# Altium project DMX Interface DB v2.PrjPcb
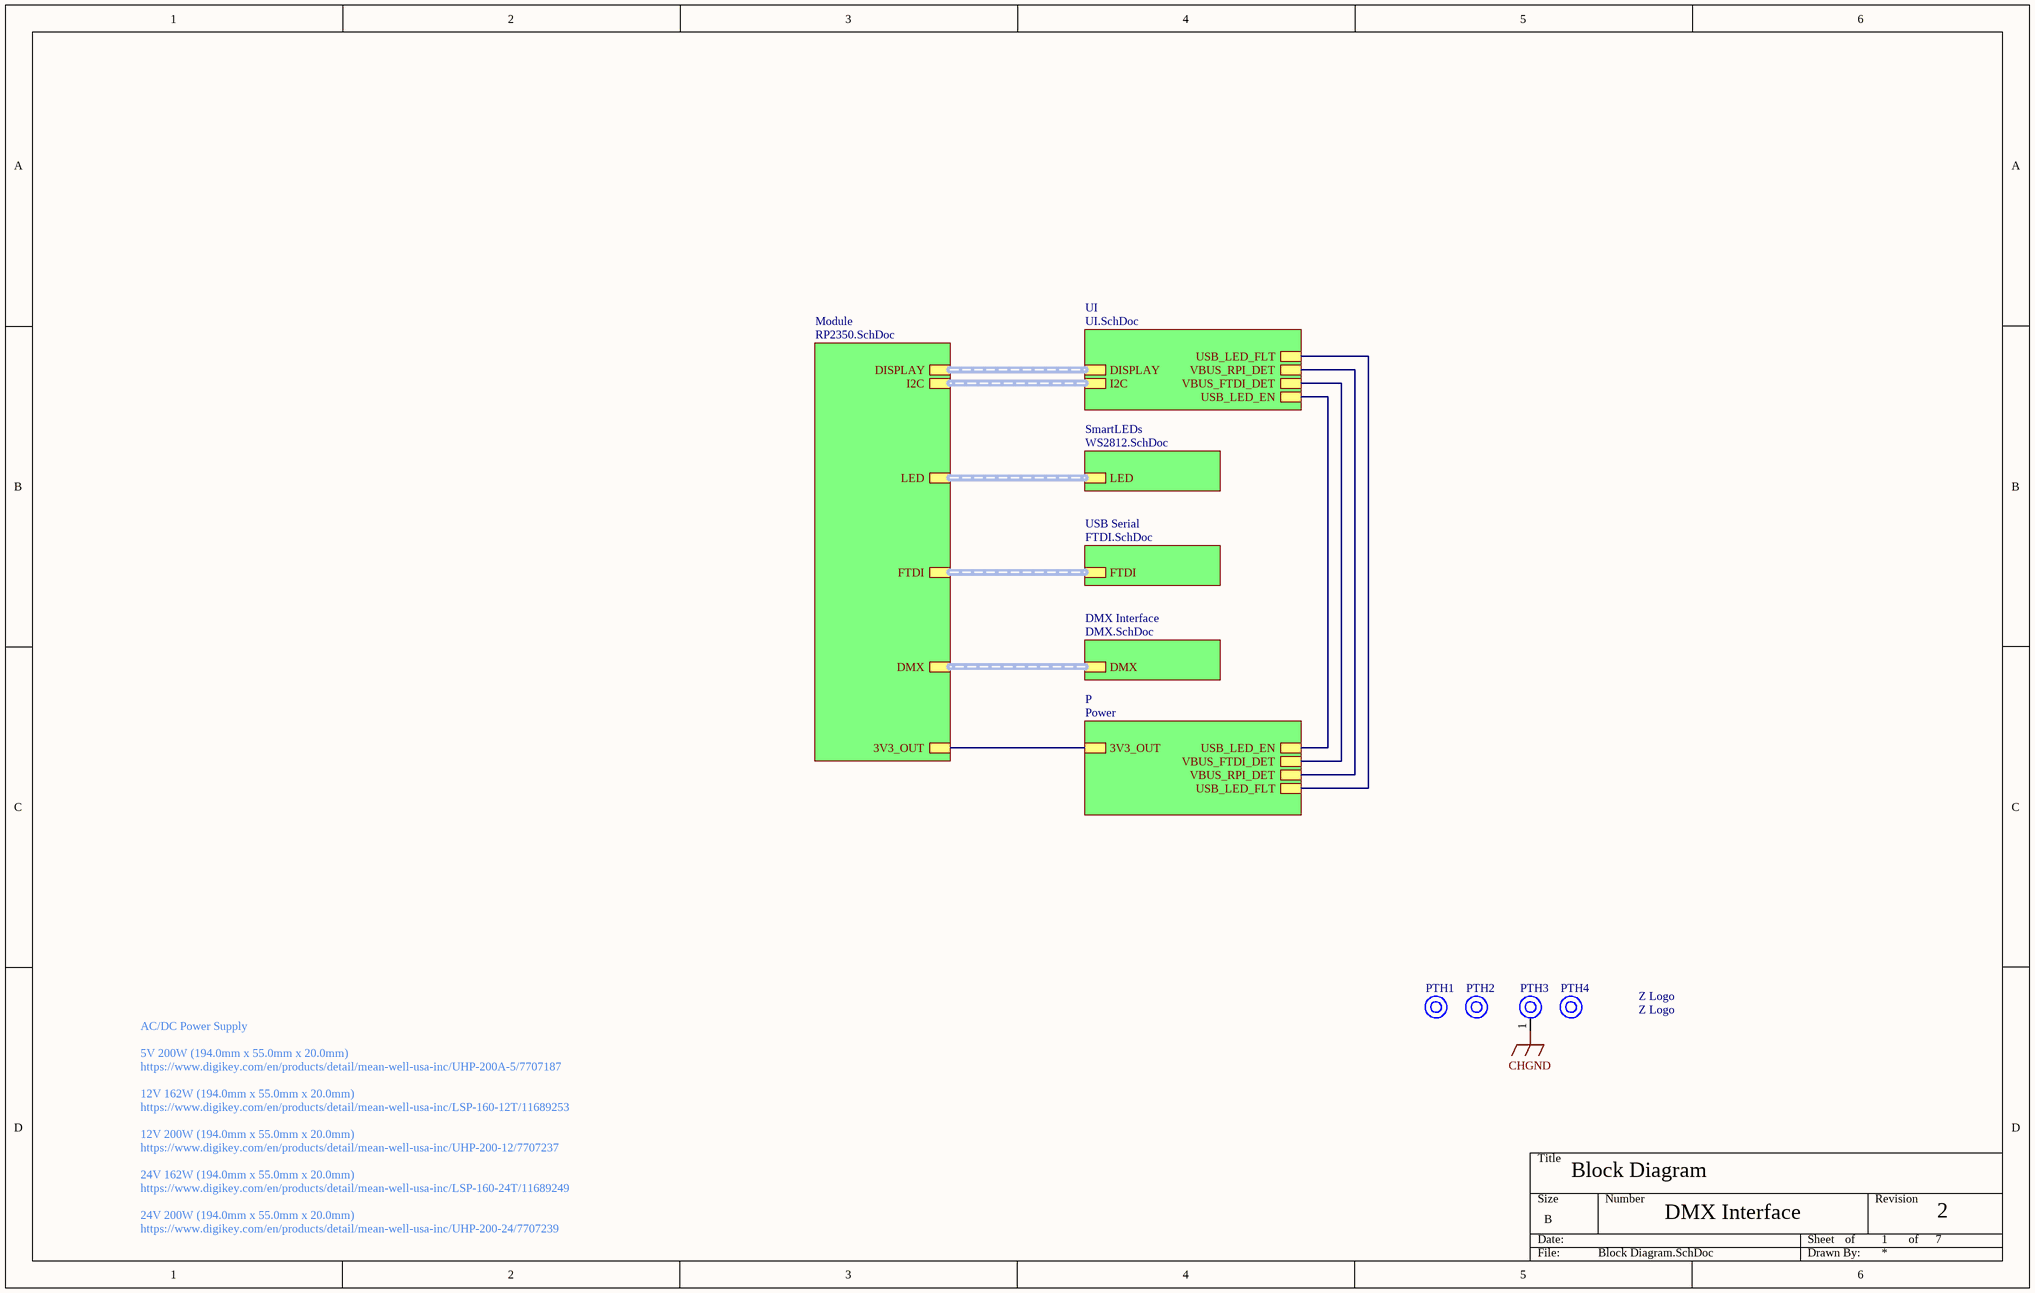
[diagram p0: Block Diagram.SchDoc]
PROJECT_TITLE: DMX Interface; REV: 2
7 sheets, 152 parts. Net scope: hierarchical (ports join the sheet entries above them; power ports are global).
Board file: DMX Interface.PcbDoc
Sheets:
  Block Diagram.SchDoc
    Module = RP2350.SchDoc
    SmartLEDs = WS2812.SchDoc
    DMX Interface = DMX.SchDoc
    USB Serial = FTDI.SchDoc
    P = Power.SchDoc
    UI = UI.SchDoc

## Sheet Block Diagram.SchDoc: Block Diagram
size B; SheetNumber: 1; SheetTotal: 7

### Parts
_1  Z Logo  [Z Logo 0.5"]  (no BOM)
PTH1  Mounting Hole NPTH  [Mounting Hole M3 No Washer NPTH]  (value not drawn)  (no BOM)
PTH2  Mounting Hole NPTH  [Mounting Hole M3 No Washer NPTH]  (value not drawn)  (no BOM)
PTH3  Mounting Hole  [Mounting Hole M3 No Washer]  (value not drawn)  (no BOM)
PTH4  Mounting Hole NPTH  [Mounting Hole M3 No Washer NPTH]  (value not drawn)  (no BOM)

### Sub-sheets
DMX Interface = DMX.SchDoc: DMX (harness DMX)
Module = RP2350.SchDoc: DMX (harness DMX), FTDI (harness FTDI), I2C (harness I2C), LED (harness LED), DISPLAY (harness DISPLAY), 3V3_OUT
P = Power: 3V3_OUT, USB_LED_EN, VBUS_FTDI_DET, VBUS_RPI_DET, USB_LED_FLT
SmartLEDs = WS2812.SchDoc: LED (harness LED)
UI = UI.SchDoc: DISPLAY (harness DISPLAY), I2C (harness I2C), USB_LED_EN, VBUS_FTDI_DET, VBUS_RPI_DET, USB_LED_FLT
USB Serial = FTDI.SchDoc: FTDI (harness FTDI)

### Nets
CHGND: PTH3.1
USB_LED_EN: sheet P/USB_LED_EN, sheet UI/USB_LED_EN
USB_LED_FLT: sheet P/USB_LED_FLT, sheet UI/USB_LED_FLT
VBUS_FTDI_DET: sheet P/VBUS_FTDI_DET, sheet UI/VBUS_FTDI_DET
VBUS_RPI_DET: sheet P/VBUS_RPI_DET, sheet UI/VBUS_RPI_DET
NetJP3_1: sheet Module/3V3_OUT, sheet P/3V3_OUT

### Buses and harness runs
harness sheet DMX Interface/DMX = sheet Module/DMX
harness sheet Module/DISPLAY = sheet UI/DISPLAY
harness sheet Module/FTDI = sheet USB Serial/FTDI
harness sheet Module/I2C = sheet UI/I2C
harness sheet Module/LED = sheet SmartLEDs/LED

### Notes on the sheet
- AC/DC Power Supply
  5V 200W (194.0mm x 55.0mm x 20.0mm)
  https://www.digikey.com/en/products/detail/mean-well-usa-inc/UHP-200A-5/7707187
  12V 162W (194.0mm x 55.0mm x 20.0mm)
  https://www.digikey.com/en/products/detail/mean-well-usa-inc/LSP-160-12T/11689253
  12V 200W (194.0mm x 55.0mm x 20.0mm)
  https://www.digikey.com/en/products/detail/mean-well-usa-inc/UHP-200-12/7707237
  24V 162W (194.0mm x 55.0mm x 20.0mm)
  https://www.digikey.com/en/products/detail/mean-well-usa-inc/LSP-160-24T/11689249
  24V 200W (194.0mm x 55.0mm x 20.0mm)
  https://www.digikey.com/en/products/detail/mean-well-usa-inc/UHP-200-24/7707239
- of

### Library data of the parts
_1 = CMP-00028-00046-1: Z logo silkscreen
PTH1 PTH2 PTH4 = CMP-00028-00043-4
PTH3 = CMP-00028-00008-6

## Sheet RP2350.SchDoc: RP2350
size B; SheetNumber: 2; SheetTotal: 7
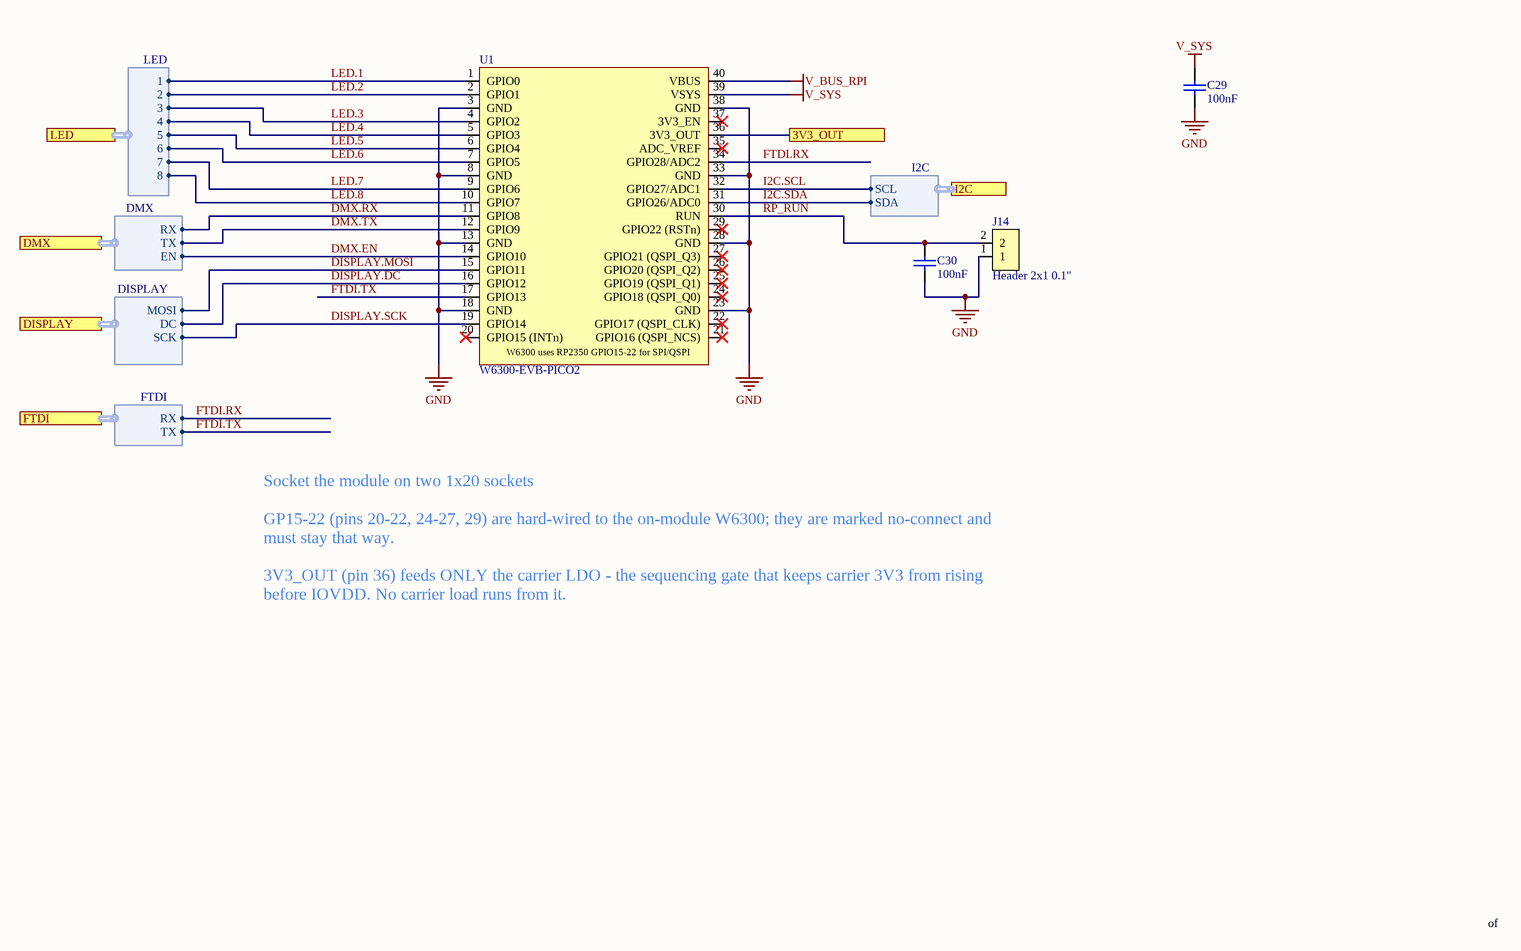
[diagram p1: RP2350.SchDoc]

### Parts
C29  value 100nF  [CAPC1608X10N_0603_MED]  (hidden comment: CC0603KRX7R0BB104)
C30  value 100nF  [CAPC1608X10N_0603_MED]  (hidden comment: CC0603KRX7R0BB104)
J14  Header 2x1 0.1"  [FP-M20-9990245-MFG]
U1  W6300-EVB-PICO2  [W6300-EVB-PICO2_0.4375_standoff]

### Ports
3V3_OUT, DISPLAY (harness DISPLAY), DMX (harness DMX), FTDI (harness FTDI), I2C (harness I2C), LED (harness LED)

### Harnesses
LED: 1, 2, 3, 4, 5, 6, 7, 8
DMX: RX, EN, TX
DISPLAY: MOSI, SCK, DC
FTDI: RX, TX
I2C: SCL, SDA

### Nets
GND: C29.2 C30.2 J14.1 U1.3(GND) U1.8(GND) U1.13(GND) U1.18(GND) U1.23(GND) U1.28(GND) U1.33(GND) U1.38(GND)
V_BUS_RPI: U1.40(VBUS)
V_SYS: C29.1 U1.39(VSYS)
DISPLAY.DC: U1.16(GPIO12) ; port DISPLAY.DC
DISPLAY.MOSI: U1.15(GPIO11) ; port DISPLAY.MOSI
DISPLAY.SCK: U1.19(GPIO14) ; port DISPLAY.SCK
DMX.EN: U1.14(GPIO10) ; port DMX.EN
DMX.RX: U1.11(GPIO8) ; port DMX.RX
DMX.TX: U1.12(GPIO9) ; port DMX.TX
FTDI.RX: U1.34(GPIO28/ADC2) ; port FTDI.RX
FTDI.TX: U1.17(GPIO13) ; port FTDI.TX
I2C.SCL: U1.32(GPIO27/ADC1) ; port I2C.SCL
I2C.SDA: U1.31(GPIO26/ADC0) ; port I2C.SDA
LED.1: U1.1(GPIO0) ; port LED.1
LED.2: U1.2(GPIO1) ; port LED.2
LED.3: U1.4(GPIO2) ; port LED.3
LED.4: U1.5(GPIO3) ; port LED.4
LED.5: U1.6(GPIO4) ; port LED.5
LED.6: U1.7(GPIO5) ; port LED.6
LED.7: U1.9(GPIO6) ; port LED.7
LED.8: U1.10(GPIO7) ; port LED.8
RP_RUN: C30.1 J14.2 U1.30(RUN)
NetJP3_1: U1.36(3V3_OUT) ; port 3V3_OUT

Not connected (* = marked no-connect by the designer): U1 20(GPIO15_(INTn))* 21(GPIO16_(QSPI_NCS))* 22(GPIO17_(QSPI_CLK))* 24(GPIO18_(QSPI_Q0))* 25(GPIO19_(QSPI_Q1))* 26(GPIO20_(QSPI_Q2))* 27(GPIO21_(QSPI_Q3))* 29(GPIO22_(RSTn))* 35(ADC_VREF)* 37(3V3_EN)*

### Notes on the sheet
- Socket the module on two 1x20 sockets
  GP15-22 (pins 20-22, 24-27, 29) are hard-wired to the on-module W6300; they are marked no-connect and must stay that way.
  3V3_OUT (pin 36) feeds ONLY the carrier LDO - the sequencing gate that keeps carrier 3V3 from rising before IOVDD. No carrier load runs from it.
- of
- (in symbol CMP-020-00030-3) W6300 uses RP2350 GPIO15-22 for SPI/QSPI

### Library data of the parts
C29 C30 = CMP-001-00102-4: Ceramic Capacitor, Multilayer, Ceramic, 100V, 10% +Tol, 10% -Tol, X7R, 15% TC, 0.1uF, Surface Mount, 0603; Max Operating Temperature: 125°C; RoHS Compliant: Yes; Case/Package: 0603; Mounting Technology: Surface Mount; Capacitor Type: Ceramic; Pins: 2; Voltage Rating: 100V; Min Operating Temperature: -55°C; JLCPN: C113803
J14 = CMP-002-00082-2: Conn Header Vert 2POS 2.54MM; Connector Type: BOARD CONNECTOR; Min Operating Temperature: -40°C; Mounting Technology: Through Hole; Pins: 2; Max Operating Temperature: 105°C; RoHS Compliant: Yes
U1 = CMP-020-00030-3: Raspberry Pi RP2350 and fully hardwired TCP/IP controller W6300

## Sheet WS2812.SchDoc: Smart LED
size B; SheetNumber: 3; SheetTotal: 7
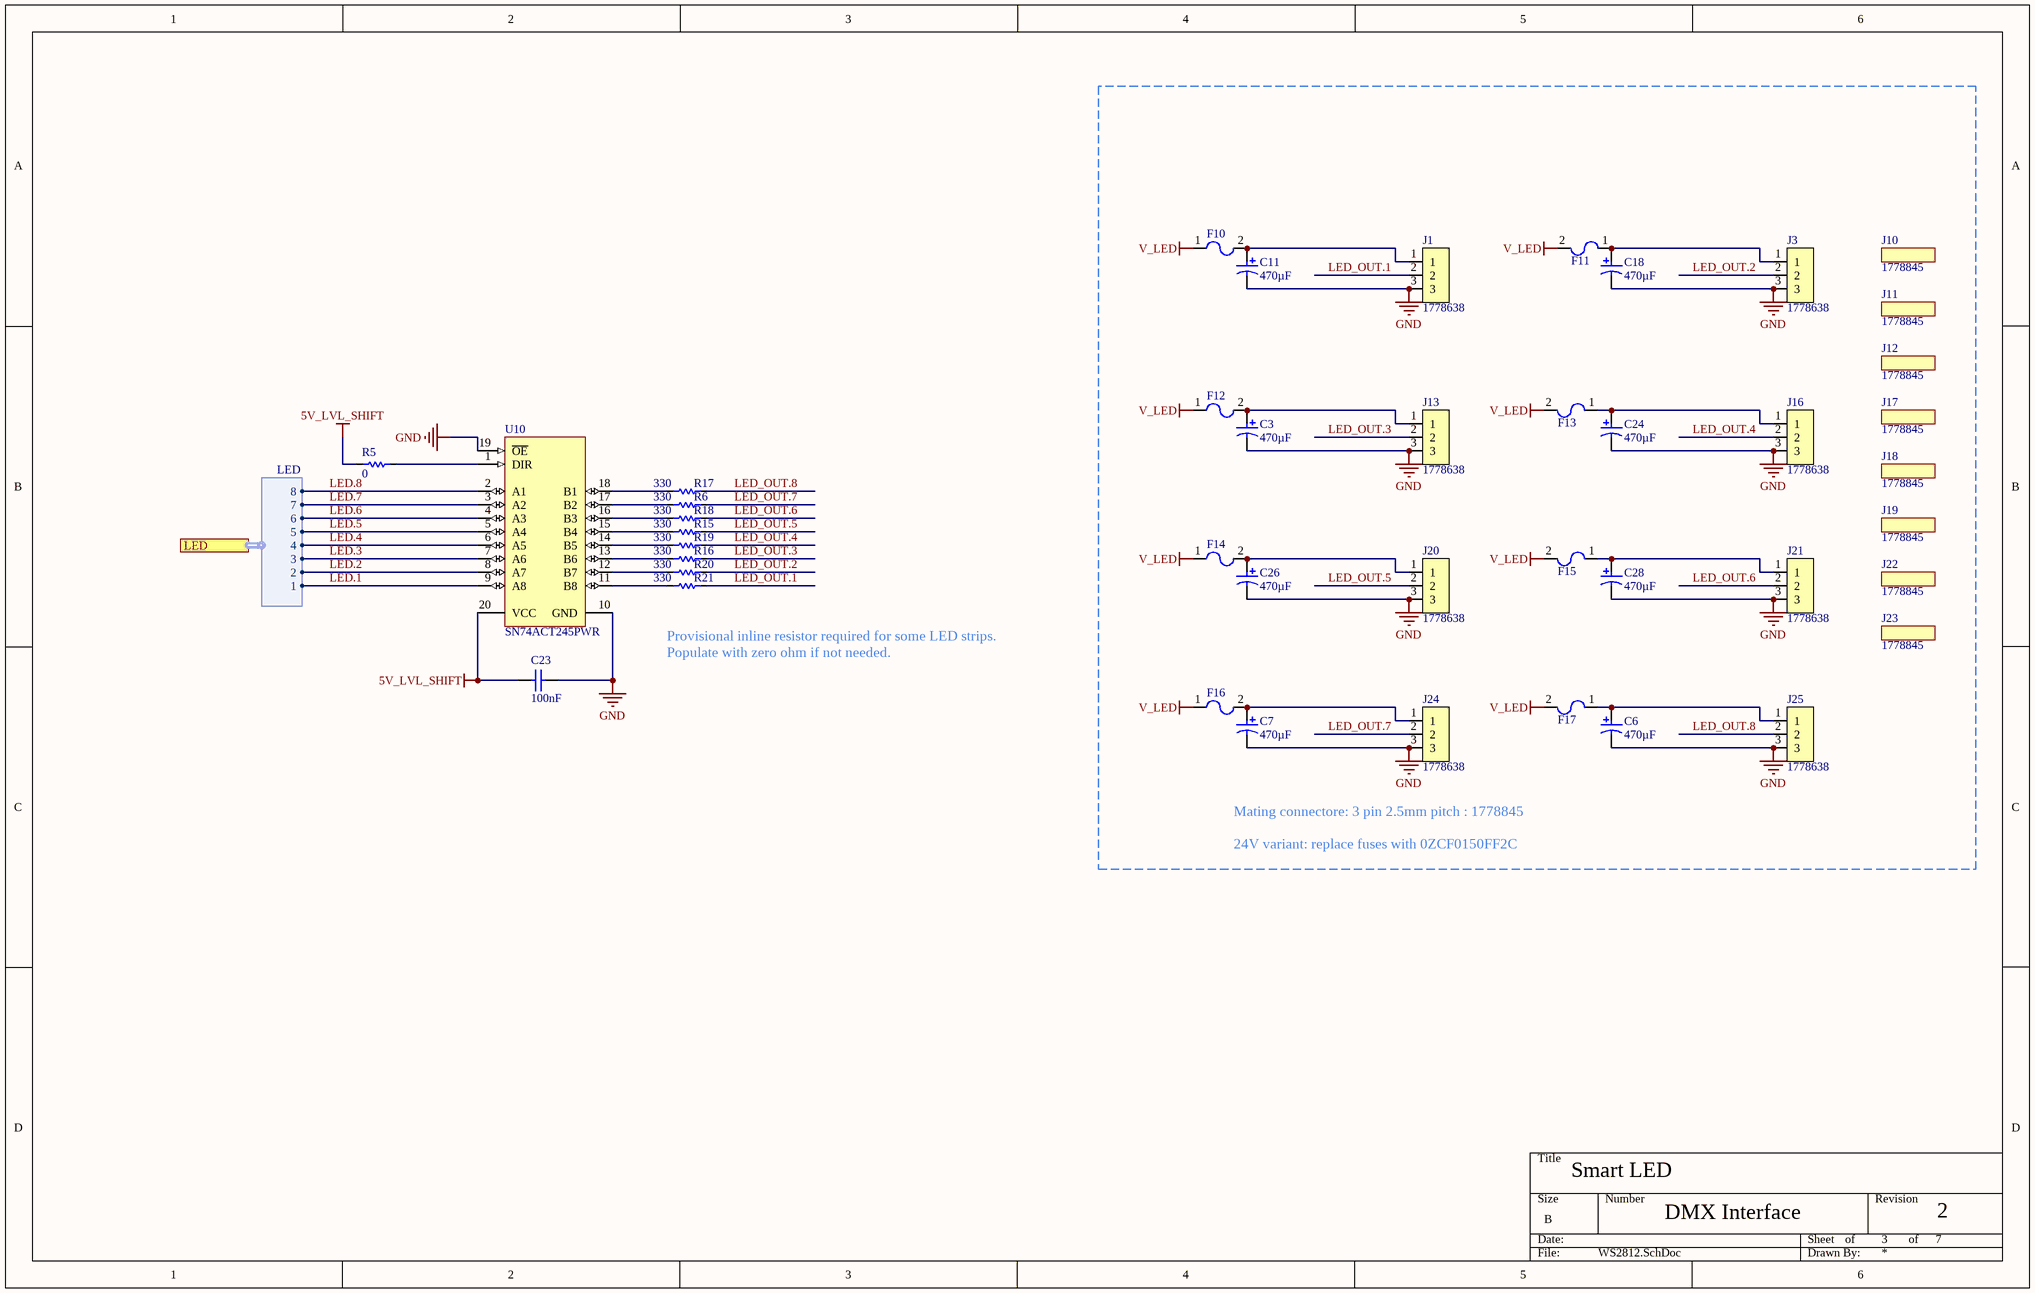
[diagram p2: WS2812.SchDoc]

### Parts
C3  value 470µF  [CAP_POL_DIAM10_H22_SPACING5]  (hidden comment: REH1020471M050K)
C6  value 470µF  [CAP_POL_DIAM10_H22_SPACING5]  (hidden comment: REH1020471M050K)
C7  value 470µF  [CAP_POL_DIAM10_H22_SPACING5]  (hidden comment: REH1020471M050K)
C11  value 470µF  [CAP_POL_DIAM10_H22_SPACING5]  (hidden comment: REH1020471M050K)
C18  value 470µF  [CAP_POL_DIAM10_H22_SPACING5]  (hidden comment: REH1020471M050K)
C23  value 100nF  [CAPC1608X10N_0603_MED]  (hidden comment: CC0603KRX7R0BB104)
C24  value 470µF  [CAP_POL_DIAM10_H22_SPACING5]  (hidden comment: REH1020471M050K)
C26  value 470µF  [CAP_POL_DIAM10_H22_SPACING5]  (hidden comment: REH1020471M050K)
C28  value 470µF  [CAP_POL_DIAM10_H22_SPACING5]  (hidden comment: REH1020471M050K)
F10  0ZCF0300BF2C  [0ZCF0300BF2C-Footprint-1]  (value not drawn)
F11  0ZCF0300BF2C  [0ZCF0300BF2C-Footprint-1]  (value not drawn)
F12  0ZCF0300BF2C  [0ZCF0300BF2C-Footprint-1]  (value not drawn)
F13  0ZCF0300BF2C  [0ZCF0300BF2C-Footprint-1]  (value not drawn)
F14  0ZCF0300BF2C  [0ZCF0300BF2C-Footprint-1]  (value not drawn)
F15  0ZCF0300BF2C  [0ZCF0300BF2C-Footprint-1]  (value not drawn)
F16  0ZCF0300BF2C  [0ZCF0300BF2C-Footprint-1]  (value not drawn)
F17  0ZCF0300BF2C  [0ZCF0300BF2C-Footprint-1]  (value not drawn)
J1  1778638  [1778638-Footprint-1]
J3  1778638  [1778638-Footprint-1]
J10  1778845  [1778845-Footprint-1]  (mechanical)
J11  1778845  [1778845-Footprint-1]  (mechanical)
J12  1778845  [1778845-Footprint-1]  (mechanical)
J13  1778638  [1778638-Footprint-1]
J16  1778638  [1778638-Footprint-1]
J17  1778845  [1778845-Footprint-1]  (mechanical)
J18  1778845  [1778845-Footprint-1]  (mechanical)
J19  1778845  [1778845-Footprint-1]  (mechanical)
J20  1778638  [1778638-Footprint-1]
J21  1778638  [1778638-Footprint-1]
J22  1778845  [1778845-Footprint-1]  (mechanical)
J23  1778845  [1778845-Footprint-1]  (mechanical)
J24  1778638  [1778638-Footprint-1]
J25  1778638  [1778638-Footprint-1]
R5  value 0  [RESC1608X06N_0603_MED]  (hidden comment: RC0603FR-070RL)
R6  value 330  [RESC1608X06N_0603_MED]  (hidden comment: RC0603FR-07330RL)
R15  value 330  [RESC1608X06N_0603_MED]  (hidden comment: RC0603FR-07330RL)
R16  value 330  [RESC1608X06N_0603_MED]  (hidden comment: RC0603FR-07330RL)
R17  value 330  [RESC1608X06N_0603_MED]  (hidden comment: RC0603FR-07330RL)
R18  value 330  [RESC1608X06N_0603_MED]  (hidden comment: RC0603FR-07330RL)
R19  value 330  [RESC1608X06N_0603_MED]  (hidden comment: RC0603FR-07330RL)
R20  value 330  [RESC1608X06N_0603_MED]  (hidden comment: RC0603FR-07330RL)
R21  value 330  [RESC1608X06N_0603_MED]  (hidden comment: RC0603FR-07330RL)
U10  SN74ACT245PWR  [PW0020A_L]

### Ports
LED (harness LED)

### Harnesses
LED: 8, 7, 6, 5, 4, 3, 2, 1

### Nets
5V_LVL_SHIFT: C23.2 R5.2 U10.20(VCC)
GND: C3.2 C6.2 C7.2 C11.2 C18.2 C23.1 C24.2 C26.2 C28.2 J1.3 J3.3 J13.3 J16.3 J20.3 J21.3 J24.3 J25.3 U10.10(GND) U10.19(~{OE})
V_LED: F10.1 F11.2 F12.1 F13.2 F14.1 F15.2 F16.1 F17.2
LED.1: U10.9(A8) ; port LED.1
LED.2: U10.8(A7) ; port LED.2
LED.3: U10.7(A6) ; port LED.3
LED.4: U10.6(A5) ; port LED.4
LED.5: U10.5(A4) ; port LED.5
LED.6: U10.4(A3) ; port LED.6
LED.7: U10.3(A2) ; port LED.7
LED.8: U10.2(A1) ; port LED.8
LED_OUT.1: J1.2 R21.2
LED_OUT.2: J3.2 R20.2
LED_OUT.3: J13.2 R16.2
LED_OUT.4: J16.2 R19.2
LED_OUT.5: J20.2 R15.2
LED_OUT.6: J21.2 R18.2
LED_OUT.7: J24.2 R6.2
LED_OUT.8: J25.2 R17.2
NetC3_1: C3.1 F12.2 J13.1
NetC6_1: C6.1 F17.1 J25.1
NetC7_1: C7.1 F16.2 J24.1
NetC11_1: C11.1 F10.2 J1.1
NetC18_1: C18.1 F11.1 J3.1
NetC24_1: C24.1 F13.1 J16.1
NetC26_1: C26.1 F14.2 J20.1
NetC28_1: C28.1 F15.1 J21.1
NetR5_1: R5.1 U10.1(DIR)
NetR6_1: R6.1 U10.17(B2)
NetR15_1: R15.1 U10.15(B4)
NetR16_1: R16.1 U10.13(B6)
NetR17_1: R17.1 U10.18(B1)
NetR18_1: R18.1 U10.16(B3)
NetR19_1: R19.1 U10.14(B5)
NetR20_1: R20.1 U10.12(B7)
NetR21_1: R21.1 U10.11(B8)

### Notes on the sheet
- Provisional inline resistor required for some LED strips. Populate with zero ohm if not needed.
- Mating connectore: 3 pin 2.5mm pitch : 1778845
  24V variant: replace fuses with 0ZCF0150FF2C
- of

### Library data of the parts
C3 C6 C7 C11 C18 C24 C26 C28 = CMP-001-00166-2: CAP ALUM 470UF 20% 50V RADIAL TH; Capacitor Type: Aluminium; RoHS Compliant: Yes; Case/Package: Radial; Tolerance: 20%; Voltage Rating: 50V; Min Operating Temperature: 125°C; Max Operating Temperature: -40°C; Mounting Technology: Through Hole; Pins: 2
C23 = CMP-001-00102-4: as C29 on sheet RP2350; Max Operating Temperature: 125°C; RoHS Compliant: Yes; Case/Package: 0603; Mounting Technology: Surface Mount; Capacitor Type: Ceramic; Pins: 2; Voltage Rating: 100V; Min Operating Temperature: -55°C; JLCPN: C113803
F10-F17 = CMP-005-00023-1: Polymeric PTC Resettable Fuse 24V 3 A Ih Surface Mount 2920 (7351 Metric), Conca; Current Rating: 3A; Min Operating Temperature: -40°C; Mounting Technology: Surface Mount; Max Operating Temperature: 85°C
J1 J3 J13 J16 J20 J21 J24 J25 = CMP-002-00251-3: Terminal Block, Header, R/A, 3Way, Th;; Voltage Rating: 160V; Max Current Rating: 6A; Connector Type: Plug; Pins: 3; Mounting Technology: Through Hole
J10-J12 J17-J19 J22 J23 = CMP-002-00252-2: Terminal Block Connector; Plug; Mini; Spring Cage; 3; 2.5 mm; 26-20 AWG; 5 A; 150 V; Connector Type: Socket; Max Current Rating: 6A; Voltage Rating: 160V; Pins: 3; Mounting Technology: Cable, Free Hanging
R5 = CMP-009-00204-6: RC Series 0603 0.1 W 0 Ohm Jumper Surface Mount Thick Film Chip Resistor; Tolerance: 1%; Voltage Rating: 75V; Power: 100mW; Min Operating Temperature: -55°C; Pins: 2; Case/Package: 0603; Max Operating Temperature: 155°C; RoHS Compliant: Yes; Mounting Technology: Surface Mount; JLCPN: C21189
R6 R15-R21 = CMP-009-00302-3: Fixed Resistor, Metal Glaze/thick Film, 0.1W, 330ohm, 75V, 1% +/-Tol, 100ppm/Cel, Surface Mount, 0603; Power: 100mW; Voltage Rating: 50V; Min Operating Temperature: -55°C; Pins: 2; RoHS Compliant: Yes; Tolerance: 1%; Mounting Technology: Surface Mount; Max Operating Temperature: 155°C; Case/Package: 0603; JLCPN: C23138
U10 = CMP-016-00027-3: Bus Transceiver, ACT Series, 1-Func, 8-Bit, True Output, CMOS, PDSO20; Min Supply Voltage: 4.5V; Max Supply Voltage: 5.5V; Nominal Supply Voltage: 5V; Min Operating Temperature: -40°C; RoHS Compliant: Yes; Case/Package: TSSOP; Pins: 20; Max Operating Temperature: 85°C; Logic Type: BUS TRANSCEIVER; JLCPN: C6931

## Sheet DMX.SchDoc: DMX / RS485
size B; SheetNumber: 4; SheetTotal: 7; SPICEModelCacheBNOSHSNT: <root> / <DocumentId>BNOSHSNT</DocumentId> / <CacheFrame Number="0"> / <Model Name="di_2n7002k" Kind="MDL"> / <Text>*SRC=2N7002K;DI_2N7002K;MOSFETs N;Enh;60.0V 0.300A 2.00ohms  Diodes Inc. MOSFET / .MODEL DI_2N7002K  NMOS( LEVEL=1 VTO=2.50 KP=32.0m  GAMMA=3.10 / + PHI=.75  LAMBDA=104u RD=0.280 RS=0.280 / + IS=150f  PB=0.800 MJ=0.460 CBD=98.8p / + CBS=119p  CGSO=60.0n CGDO=50.0n CGBO=390n  )</Text> / </Model> / </CacheFrame> / </root>
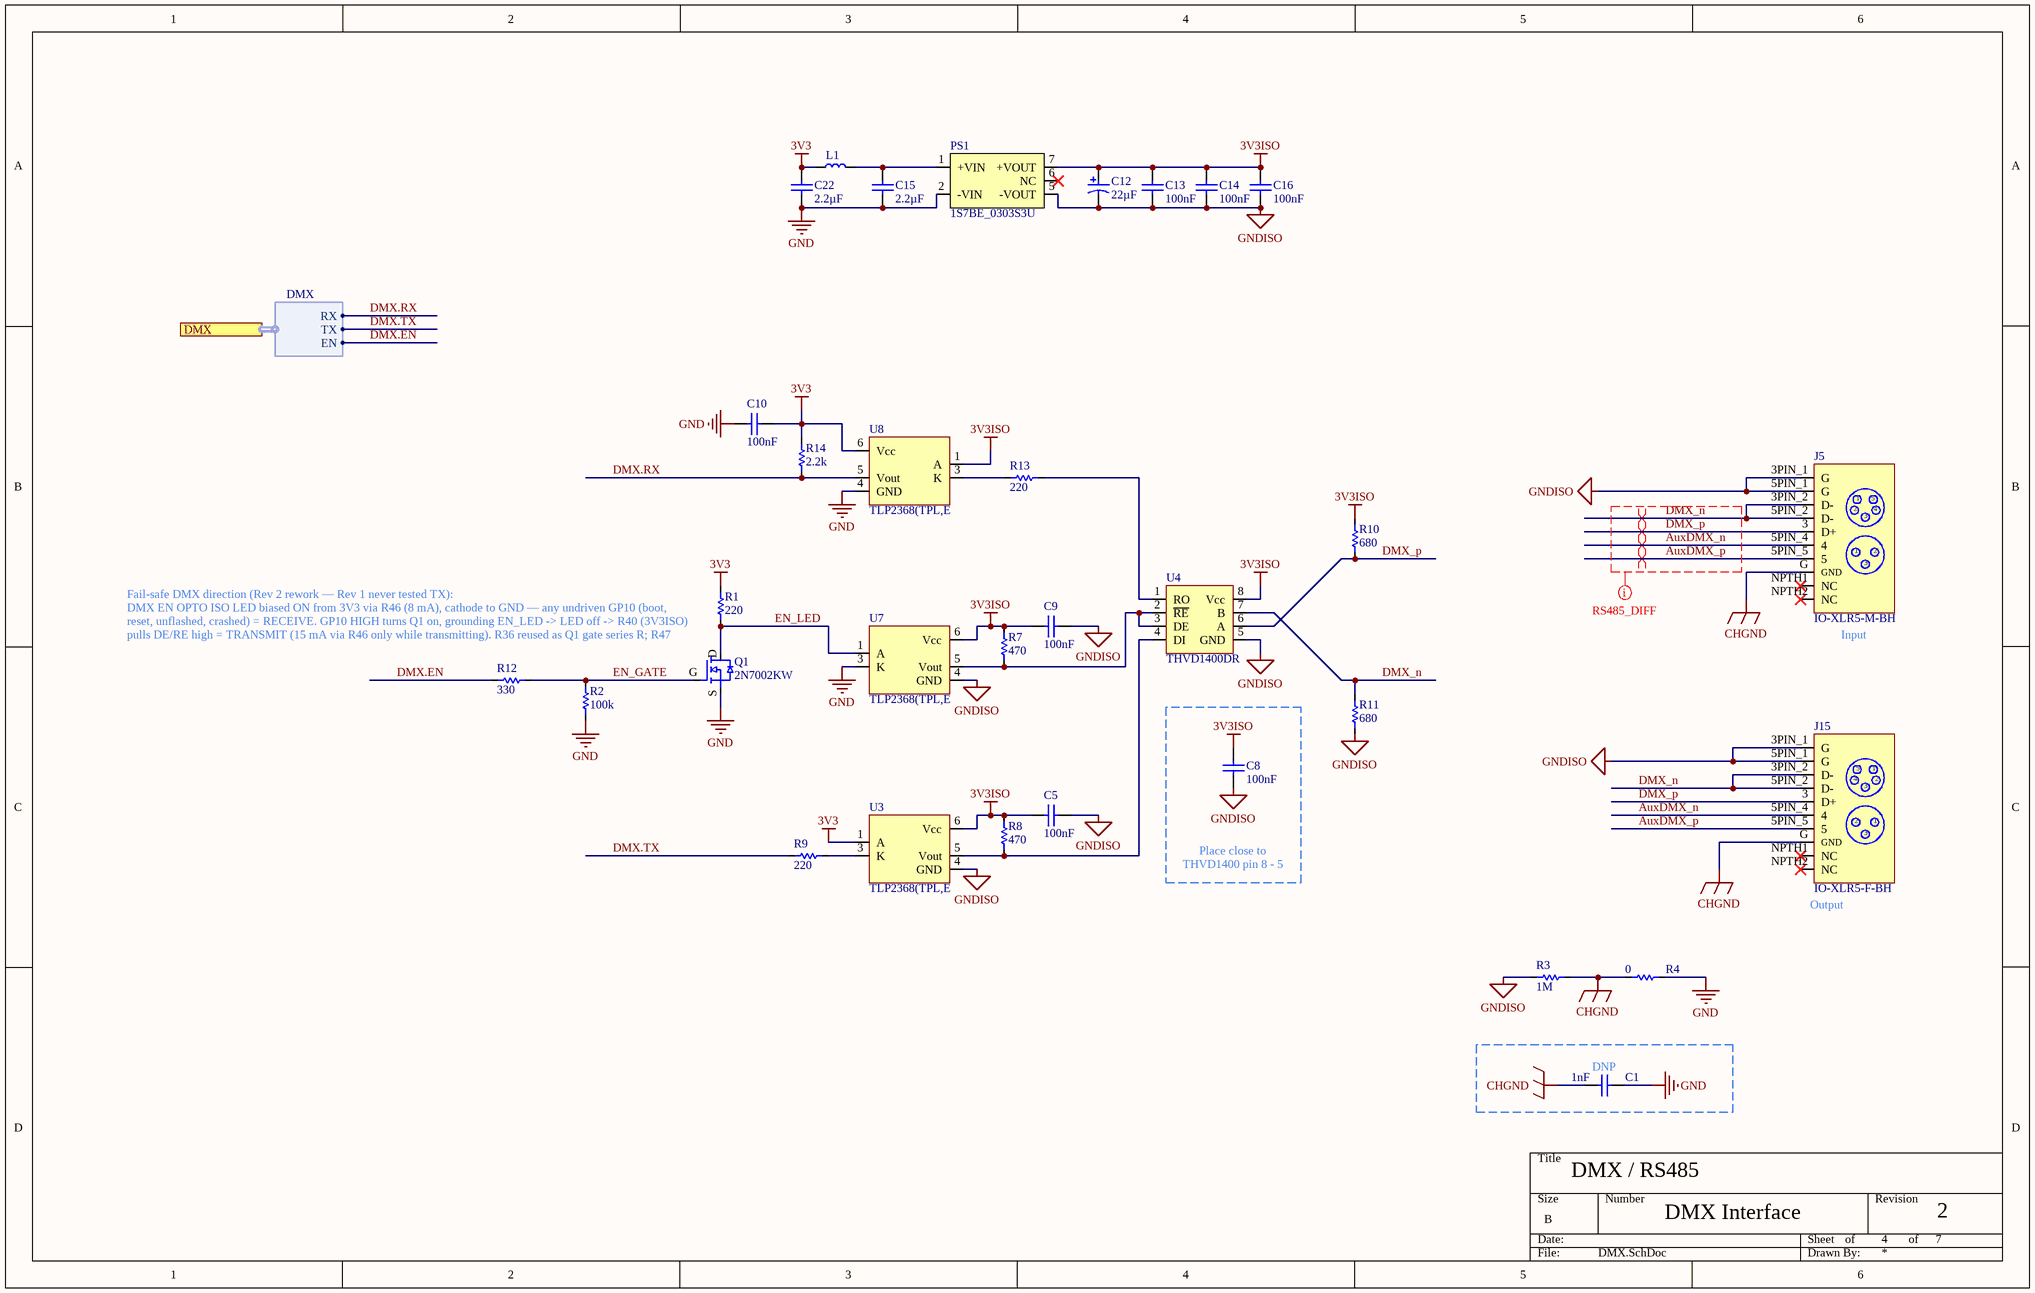
[diagram p3: DMX.SchDoc]

### Parts
C1  value 1nF  [CAPC1608X10N_0603_MED]  (hidden comment: C0603C102K5RACTU)
C5  value 100nF  [CAPC1608X10N_0603_MED]  (hidden comment: CC0603KRX7R0BB104)
C8  value 100nF  [CAPC1608X10N_0603_MED]  (hidden comment: CC0603KRX7R0BB104)
C9  value 100nF  [CAPC1608X10N_0603_MED]  (hidden comment: CC0603KRX7R0BB104)
C10  value 100nF  [CAPC1608X10N_0603_MED]  (hidden comment: CC0603KRX7R0BB104)
C12  value 22µF  [CAPCP3528X21N_1210_1411_MED]  (hidden comment: TPSB226K010R0500)
C13  value 100nF  [CAPC1608X10N_0603_MED]  (hidden comment: CC0603KRX7R0BB104)
C14  value 100nF  [CAPC1608X10N_0603_MED]  (hidden comment: CC0603KRX7R0BB104)
C15  value 2.2µF  [CAPC2012X14N_0805_MED]  (hidden comment: CGA4J3X7R1H225K125AE)
C16  value 100nF  [CAPC1608X10N_0603_MED]  (hidden comment: CC0603KRX7R0BB104)
C22  value 2.2µF  [CAPC2012X14N_0805_MED]  (hidden comment: CGA4J3X7R1H225K125AE)
J5  IO-XLR5-M-BH  [IO-XLR5-M-BH-Footprint-1]
J15  IO-XLR5-F-BH  [IO-XLR5-F-BH-Footprint-1]
L1  SRR6038-180Y  [IND_SRR6038-180Y]  (value not drawn)
PS1  1S7BE_0303S3U  [CONV_1S7BE_0303S3U]
Q1  2N7002KW  [ONSEMI_SOT65P210X110-3N]
R1  value 220  [RESC1608X06N_0603_MED]  (hidden comment: RC0603FR-07220RL)
R2  value 100k  [RESC1608X06N_0603_MED]  (hidden comment: RC0603DR-07100KL)
R3  value 1M  [RESC1608X06N_0603_MED]  (hidden comment: RC0603FR-071ML)
R4  value 0  [RESC1608X06N_0603_MED]  (hidden comment: RC0603FR-070RL)
R7  value 470  [RESC1608X06N_0603_MED]  (hidden comment: RC0603FR-07470RL)
R8  value 470  [RESC1608X06N_0603_MED]  (hidden comment: RC0603FR-07470RL)
R9  value 220  [RESC1608X06N_0603_MED]  (hidden comment: RC0603FR-07220RL)
R10  value 680  [RESC1608X06N_0603_MED]  (hidden comment: RC0603FR-07680RL)
R11  value 680  [RESC1608X06N_0603_MED]  (hidden comment: RC0603FR-07680RL)
R12  value 330  [RESC1608X06N_0603_MED]  (hidden comment: RC0603FR-07330RL)
R13  value 220  [RESC1608X06N_0603_MED]  (hidden comment: RC0603FR-07220RL)
R14  value 2.2k  [RESC1608X06N_0603_MED]  (hidden comment: RC0603FR-072K2L)
U3  TLP2368(TPL,E  [SOT125P700X220-5N]
U4  THVD1400DR  [SOIC127P600X175-8N]
U7  TLP2368(TPL,E  [SOT125P700X220-5N]
U8  TLP2368(TPL,E  [SOT125P700X220-5N]

### Ports
DMX (harness DMX)

### Harnesses
DMX: RX, EN, TX

### Nets
3V3: C10.1 C22.2 L1.1 R1.2 R14.2 U3.1(A) U8.6(Vcc)
3V3ISO: C5.2 C8.1 C9.2 C12.1 C13.2 C14.2 C16.2 PS1.7(+VOUT) R7.2 R8.2 R10.2 U3.6(Vcc) U4.8(Vcc) U7.6(Vcc) U8.1(A)
CHGND: C1.1 J5.G(GND) J15.G(GND) R3.2 R4.1
GND: C1.2 C10.2 C15.1 C22.1 PS1.2(-VIN) Q1.S R2.1 R4.2 U7.3(K) U8.4(GND)
GNDISO: C5.1 C8.2 C9.1 C12.2 C13.1 C14.1 C16.1 J5.3PIN_1(G) J5.5PIN_1(G) J15.3PIN_1(G) J15.5PIN_1(G) PS1.5(-VOUT) R3.1 R11.1 U3.4(GND) U4.5(GND) U7.4(GND)
AuxDMX_n: J5.5PIN_4(4) J15.5PIN_4(4)
AuxDMX_p: J5.5PIN_5(5) J15.5PIN_5(5)
DMX.EN: R12.1 ; port DMX.EN
DMX.RX: R14.1 U8.5(Vout) ; port DMX.RX
DMX.TX: R9.1 ; port DMX.TX
DMX_n: J5.3PIN_2(D-) J5.5PIN_2(D-) J15.3PIN_2(D-) J15.5PIN_2(D-) R11.2 U4.7(B)
DMX_p: J5.3(D+) J15.3(D+) R10.1 U4.6(A)
EN_GATE: Q1.G R2.2 R12.2
EN_LED: Q1.D R1.1 U7.1(A)
NetC15_2: C15.2 L1.2 PS1.1(+VIN)
NetR7_1: R7.1 U4.2(~{RE}) U4.3(DE) U7.5(Vout)
NetR8_1: R8.1 U3.5(Vout) U4.4(DI)
NetR9_2: R9.2 U3.3(K)
NetR13_1: R13.1 U8.3(K)
NetR13_2: R13.2 U4.1(RO)

Not connected (* = marked no-connect by the designer): J5 NPTH1(NC)* NPTH2(NC)*; J15 NPTH1(NC)* NPTH2(NC)*; PS1 6(NC)*

### Layout directives
differential pair; differential pair class 120DP: AuxDMX_n, AuxDMX_p, DMX_n, DMX_p
rule Impedance Constraint [Min = 110.0    Max = 130.0    ]; net class RS485; rule Matched Net Lengths [Tolerance = 10mil]: AuxDMX_n, AuxDMX_p, DMX_n, DMX_p

### Notes on the sheet
- Fail-safe DMX direction (Rev 2 rework — Rev 1 never tested TX):
  DMX EN OPTO ISO LED biased ON from 3V3 via R46 (8 mA), cathode to GND — any undriven GP10 (boot, reset, unflashed, crashed) = RECEIVE. GP10 HIGH turns Q1 on, grounding EN_LED -> LED off -> R40 (3V3ISO) pulls DE/RE high = TRANSMIT (15 mA via R46 only while transmitting). R36 reused as Q1 gate series R; R47 holds gate low.
  Firmware convention unchanged: GP10 HIGH = TX, LOW/Hi-Z = RX.
- (near J5) Input
- Place close to THVD1400 pin 8 - 5
- (near J15) Output
- (near C1) DNP
- of
- (in symbol CMP-002-00191-7) 1; 2
- (in symbol CMP-002-00192-4) 1; 2

### Library data of the parts
C1 = CMP-001-00160-2: Ceramic Capacitor, Multilayer, Ceramic, 50V, 10% +Tol, 10% -Tol, X7R, 15% TC, 0.001uF, Surface Mount, 0603; Max Operating Temperature: 125°C; Case/Package: 0603; Mounting Technology: Surface Mount; Voltage Rating: 50V; Pins: 2; Tolerance: 10%; JLCPN: C2167129; RoHS Compliant: Yes; Min Operating Temperature: -55°C; Capacitor Type: Ceramic
C5 C8-C10 C13 C14 C16 = CMP-001-00102-4: as C29 on sheet RP2350; Max Operating Temperature: 125°C; RoHS Compliant: Yes; Case/Package: 0603; Mounting Technology: Surface Mount; Capacitor Type: Ceramic; Pins: 2; Voltage Rating: 100V; Min Operating Temperature: -55°C; JLCPN: C113803
C12 = CMP-001-00100-5: Tantalum Capacitor, Polarized, Tantalum (dry/solid), 10V, 10% +Tol, 10% -Tol, 22uF, Surface Mount, 1210; Case/Package: 1411; Pins: 2; Capacitor Type: Tantalum; Voltage Rating: 10V; Max Operating Temperature: 125°C; Mounting Technology: Surface Mount; Tolerance: 10%; RoHS Compliant: Yes; Min Operating Temperature: -55°C; JLCPN: C55530
C15 C22 = CMP-001-00170-2: Ceramic Capacitor, Multilayer, Ceramic, 2.2uF, 50V, 10%, X6S, 0805; Max Operating Temperature: 125°C; Min Operating Temperature: -55°C; Voltage Rating: 50V; Tolerance: 10%; Capacitor Type: Ceramic; RoHS Compliant: Yes; Pins: 2; Mounting Technology: Surface Mount; Case/Package: 0805; JLCPN: C125847
J5 = CMP-002-00191-7: B Series, 5 Pin XLR, Male, Horizontal Pcb Mount With Separate Ground Pin; Gender: Male; Connector Type: XLR; Pins: 5
J15 = CMP-002-00192-4: B-Series 5-Pin XLR Female Horizontal PCB Mount with Separate Ground-Pin Metal Face Plate; Connector Type: XLR; Pins: 5; Gender: Female
L1 = CMP-006-00028-1: General Purpose Inductor, 18uH, 30%, 1 Element, Ferrite-Core, SMD, 2727; Max Current Rating: 1.7A; Self Resonant Frequency: 13.8MHz; Min Operating Temperature: -40°C; Max Operating Temperature: 125°C; Tolerance: 30%; Pins: 2; RoHS Compliant: Yes
PS1 = CMP-112-000000-3: ISOLATED MODULE DC DC CONVERTERS; MF: Gaptec; Design Item ID: 1S7BE_0303S3U; Source: 1S7BE_0303S3U.SchLib; SnapEDA_Link: https://www.snapeda.com/parts/1S7BE_0303S3U/Gaptec/view-part/?ref=snap; Package: SIP-7 Gaptec; MP: 1S7BE_0303S3U; Check_prices: https://www.snapeda.com/parts/1S7BE_0303S3U/Gaptec/view-part/?ref=eda; Value: *
Q1 = CMP-013-00041-2: Small Signal Field-Effect Transistor, 0.31A I(D), 60V, 1-Element, N-Channel, Silicon, Metal-oxide Semiconductor FET; Max Operating Temperature: 150°C; Pins: 3; RoHS Compliant: Yes; Case/Package: SC-70, SOT-323
R1 = CMP-009-00202-2: Fixed Resistor, Metal Glaze/thick Film, 0.1W, 220ohm, 75V, 1% +/-Tol, 100ppm/Cel, Surface Mount, 0603; Voltage Rating: 50V; Power: 100mW; Pins: 2; JLCPN: C22962; Tolerance: 1%; Max Operating Temperature: 155°C; Min Operating Temperature: -55°C; Case/Package: 0603; RoHS Compliant: Yes; Mounting Technology: Surface Mount
R2 = CMP-009-00328-3: Fixed Resistor, Metal Glaze/thick Film, 0.1W, 100000ohm, 75V, 0.5% +/-Tol, 100ppm/Cel, Surface Mount, 0603; Power: 100mW; Voltage Rating: 50V; Min Operating Temperature: -55°C; Mounting Technology: Surface Mount; RoHS Compliant: Yes; Pins: 2; JLCPN: C25803; Max Operating Temperature: 155°C; Case/Package: 0603; Tolerance: 0.5%
R3 = CMP-009-00342-2: Fixed Resistor, Metal Glaze/thick Film, 0.1W, 1Mohm,; Voltage Rating: 25V; Tolerance: 1%; Power: 100mW; JLCPN: C22935; Min Operating Temperature: -55°C; Max Operating Temperature: 155°C; RoHS Compliant: Yes; Case/Package: 0603; Pins: 2; Mounting Technology: Surface Mount
R4 = CMP-009-00204-6: RC Series 0603 0.1 W 0 Ohm Jumper Surface Mount Thick Film Chip Resistor; Power: 100mW; Voltage Rating: 75V; Tolerance: 1%; Max Operating Temperature: 155°C; JLCPN: C21189; Pins: 2; Case/Package: 0603; RoHS Compliant: Yes; Mounting Technology: Surface Mount; Min Operating Temperature: -55°C
R7 R8 = CMP-009-00300-2: Fixed Resistor, Metal Glaze/thick Film, 0.1W, 470ohm, 75V, 1% +/-Tol, 100ppm/Cel, Surface Mount, 0603; Power: 100mW; Voltage Rating: 50V; Case/Package: 0603; Tolerance: 1%; Mounting Technology: Surface Mount; Max Operating Temperature: 155°C; Pins: 2; RoHS Compliant: Yes; Min Operating Temperature: -55°C; JLCPN: C114669
R9 R13 = CMP-009-00202-2: Fixed Resistor, Metal Glaze/thick Film, 0.1W, 220ohm, 75V, 1% +/-Tol, 100ppm/Cel, Surface Mount, 0603; Power: 100mW; Voltage Rating: 50V; Min Operating Temperature: -55°C; Pins: 2; RoHS Compliant: Yes; Tolerance: 1%; Mounting Technology: Surface Mount; Max Operating Temperature: 155°C; Case/Package: 0603; JLCPN: C22962
R10 R11 = CMP-009-00301-2: Fixed Resistor, Metal Glaze/thick Film, 0.1W, 680ohm, 75V, 1% +/-Tol, 100ppm/Cel, Surface Mount, 0603; Voltage Rating: 50V; Power: 100mW; Mounting Technology: Surface Mount; Min Operating Temperature: -55°C; Tolerance: 1%; Pins: 2; Case/Package: 0603; Max Operating Temperature: 155°C; RoHS Compliant: Yes; JLCPN: C112310
R12 = CMP-009-00302-3: as R6 on sheet WS2812; Min Operating Temperature: -55°C; Pins: 2; RoHS Compliant: Yes; Tolerance: 1%; Mounting Technology: Surface Mount; Max Operating Temperature: 155°C; Case/Package: 0603; JLCPN: C23138
R14 = CMP-009-00304-2: Fixed Resistor, Metal Glaze/thick Film, 0.1W, 2200ohm, 75V, 1% +/-Tol, 100ppm/Cel, Surface Mount, 0603; Power: 100mW; Voltage Rating: 50V; Min Operating Temperature: -55°C; Max Operating Temperature: 155°C; Tolerance: 1%; Case/Package: 0603; Pins: 2; Mounting Technology: Surface Mount; RoHS Compliant: Yes; JLCPN: C114662
U3 U7 U8 = CMP-00026-00002-1: Logic IC Output Optocoupler, 1-Channel, 1-Element, 3750V Isolation, 20MBps; Max Operating Temperature: 125°C; Min Operating Temperature: -40°C; RoHS Compliant: Yes; Mounting Technology: Surface Mount
U4 = CMP-015-00028-2: Line Transceiver, 1 Func, 1 Driver, 1 Rcvr, PDSO8; RoHS Compliant: Yes; JLCPN: C3235232

## Sheet FTDI.SchDoc
size B; SheetNumber: 5; SheetTotal: 7
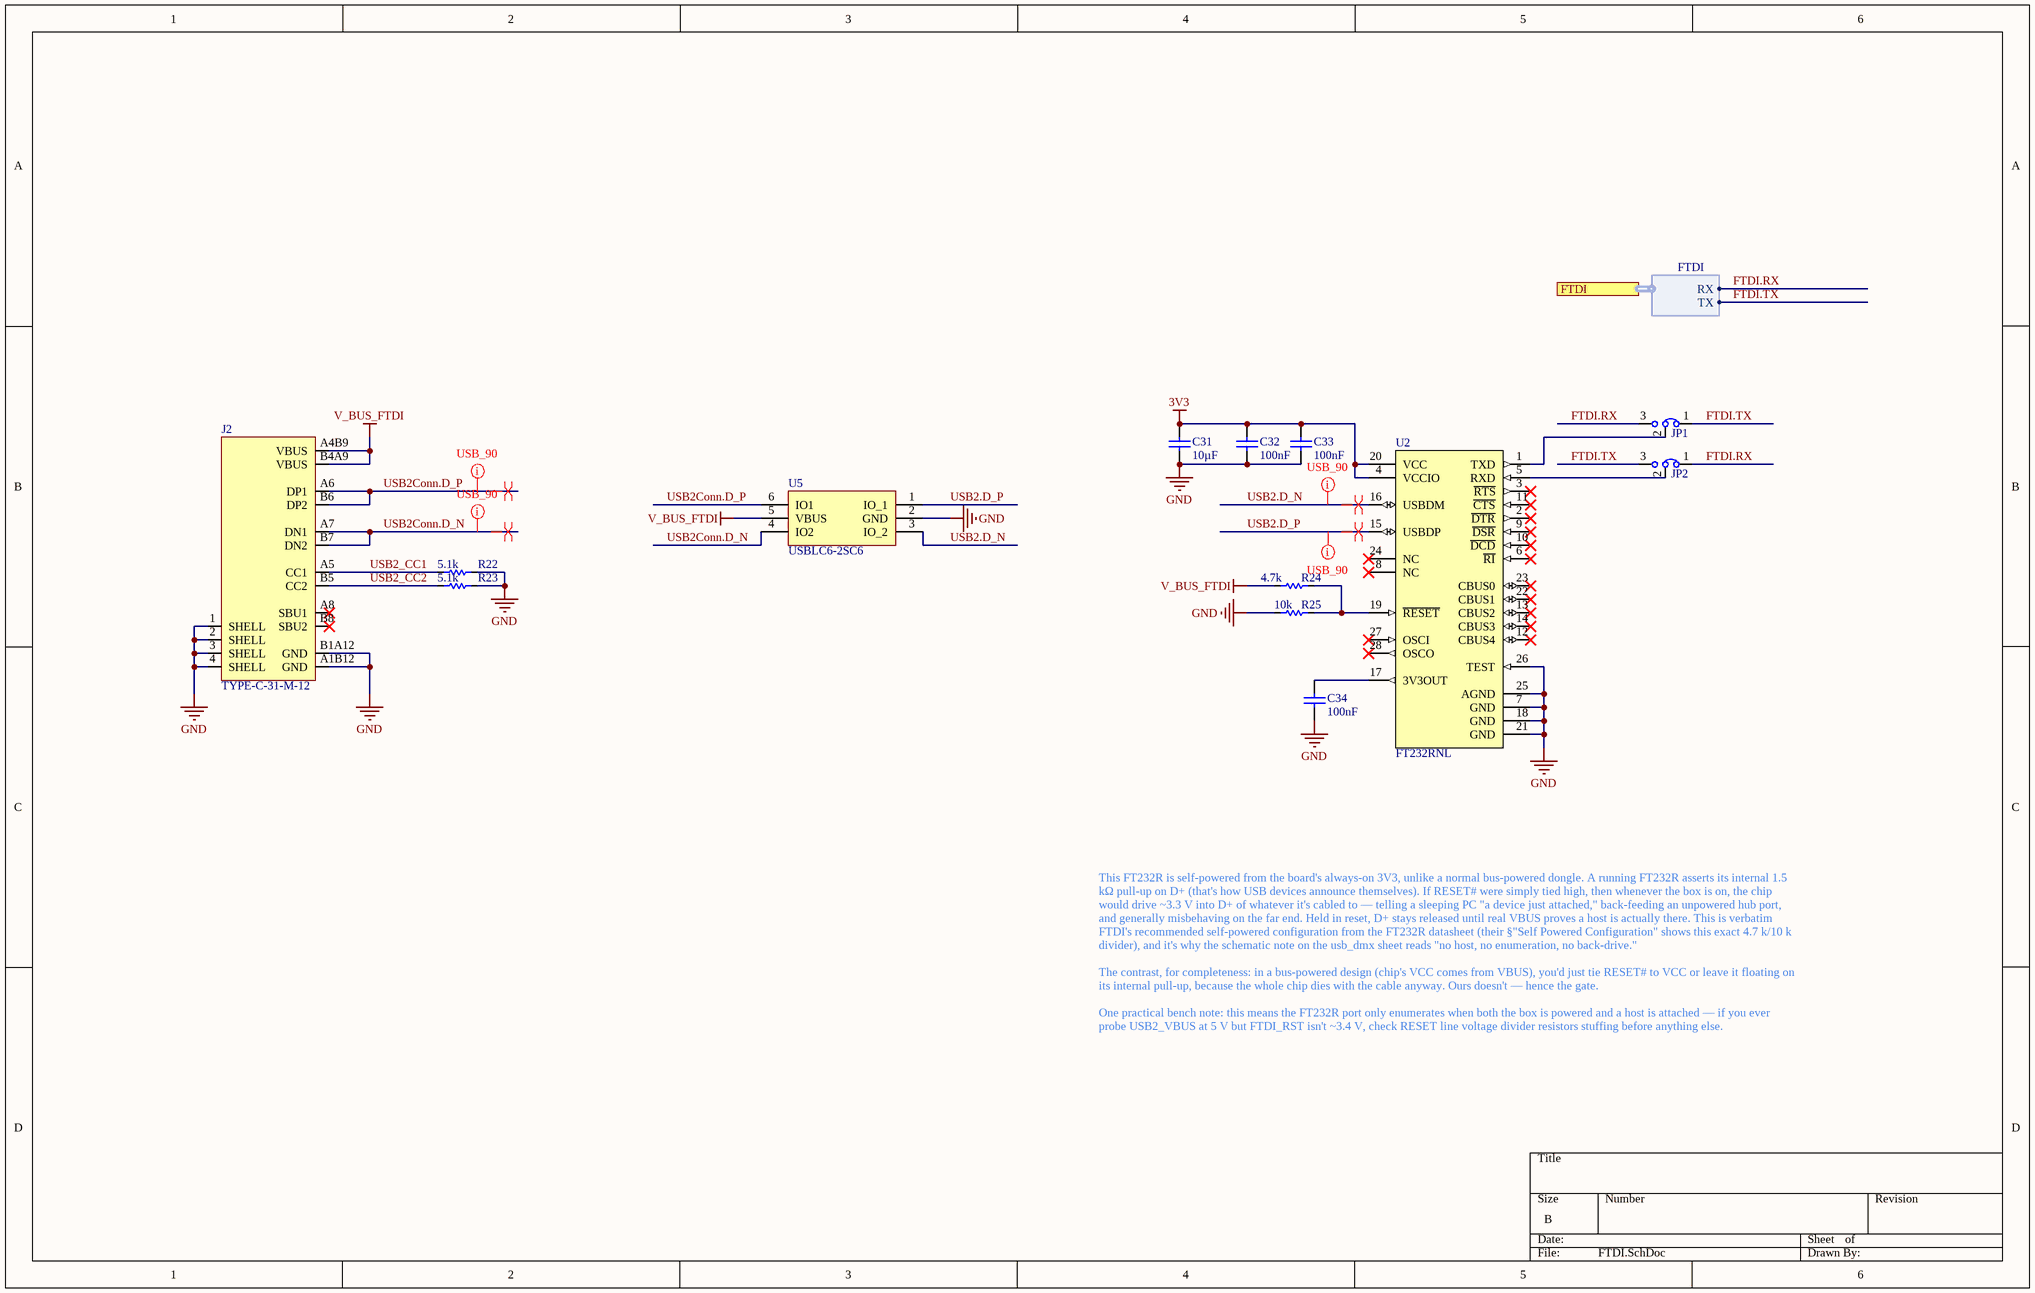
[diagram p4: FTDI.SchDoc]

### Parts
C31  value 10µF  [CAPC2012X14N_0805_MED]  (hidden comment: GRM21BC81C106KA73L)
C32  value 100nF  [CAPC1608X10N_0603_MED]  (hidden comment: CC0603KRX7R0BB104)
C33  value 100nF  [CAPC1608X10N_0603_MED]  (hidden comment: CC0603KRX7R0BB104)
C34  value 100nF  [CAPC1608X10N_0603_MED]  (hidden comment: CC0603KRX7R0BB104)
J2  TYPE-C-31-M-12  [Type-C-31-M-12]
JP1  Jumper 3 x 1 Bridge 1-2 Solder Bridge  [Jumper 3 Solder Bridge 1-2 0603]  (value not drawn)
JP2  Jumper 3 x 1 Bridge 1-2 Solder Bridge  [Jumper 3 Solder Bridge 1-2 0603]  (value not drawn)
R22  value 5.1k  [RESC1608X06N_0603_MED]  (hidden comment: RC0603FR-075K1L)
R23  value 5.1k  [RESC1608X06N_0603_MED]  (hidden comment: RC0603FR-075K1L)
R24  value 4.7k  [RESC1608X06N_0603_MED]  (hidden comment: RC0603FR-074K7L)
R25  value 10k  [RESC1608X06N_0603_MED]  (hidden comment: RC0603FR-1010KL)
U2  FT232RNL  [FP-FT232RNL-REEL-MFG]
U5  USBLC6-2SC6  [ESD_SOT23-6L]

### Ports
FTDI (harness FTDI)

### Harnesses
FTDI: RX, TX

### Nets
3V3: C31.2 C32.1 C33.1 U2.4(VCCIO) U2.20(VCC)
GND: C31.1 C32.2 C33.2 C34.2 J2.1(SHELL) J2.2(SHELL) J2.3(SHELL) J2.4(SHELL) J2.A1B12(GND) J2.B1A12(GND) R22.2 R23.2 R25.1 U2.7(GND) U2.18(GND) U2.21(GND) U2.25(AGND) U2.26(TEST) U5.2(GND)
V_BUS_FTDI: J2.A4B9(VBUS) J2.B4A9(VBUS) R24.2 U5.5(VBUS)
FTDI.RX: JP1.3 JP2.1 ; port FTDI.RX
FTDI.TX: JP1.1 JP2.3 ; port FTDI.TX
USB2.D_N: U2.16(USBDM) U5.3(IO_2)
USB2.D_P: U2.15(USBDP) U5.1(IO_1)
USB2_CC1: J2.A5(CC1) R22.1
USB2_CC2: J2.B5(CC2) R23.1
USB2Conn.D_N: J2.A7(DN1) J2.B7(DN2) U5.4(IO2)
USB2Conn.D_P: J2.A6(DP1) J2.B6(DP2) U5.6(IO1)
NetC34_1: C34.1 U2.17(3V3OUT)
NetJP1_2: JP1.2 U2.1(TXD)
NetJP2_2: JP2.2 U2.5(RXD)
NetR24_1: R24.1 R25.2 U2.19(~{RESET})

Not connected (* = marked no-connect by the designer): J2 A8(SBU1)* B8(SBU2)*; U2 2(~{DTR})* 3(~{RTS})* 6(~{RI})* 8(NC)* 9(~{DSR})* 10(~{DCD})* 11(~{CTS})* 12(CBUS4)* 13(CBUS2)* 14(CBUS3)* 22(CBUS1)* 23(CBUS0)* 24(NC)* 27(OSCI)* 28(OSCO)*

### Layout directives
rule Impedance Constraint [Min = 85.00    Max = 95.00    ]: USB2.D_N, USB2.D_P, USB2Conn.D_N, USB2Conn.D_P
differential pair; differential pair class 90DP: USB2.D_N, USB2.D_P, USB2Conn.D_N, USB2Conn.D_P

### Notes on the sheet
- This FT232R is self-powered from the board's always-on 3V3, unlike a normal bus-powered dongle. A running FT232R asserts its internal 1.5 kΩ pull-up on D+ (that's how USB devices announce themselves). If RESET# were simply tied high, then whenever the box is on, the chip would drive ~3.3 V into D+ of whatever it's cabled to — telling a sleeping PC "a device just attached," back-feeding an unpowered hub port, and generally misbehaving on the far end. Held in reset, D+ stays released until real VBUS proves a host is actually there. This is verbatim FTDI's recommended self-powered configuration from the FT232R datasheet (their §"Self Powered Configuration" shows this exact 4.7 k/10 k divider), and it's why the schematic note on the usb_dmx sheet reads "no host, no enumeration, no back-drive."
  The contrast, for completeness: in a bus-powered design (chip's VCC comes from VBUS), you'd just tie RESET# to VCC or leave it floating on its internal pull-up, because the whole chip dies with the cable anyway. Ours doesn't — hence the gate.
  One practical bench note: this means the FT232R port only enumerates when both the box is powered and a host is attached — if you ever probe USB2_VBUS at 5 V but FTDI_RST isn't ~3.4 V, check RESET line voltage divider resistors stuffing before anything else.
- Cage Code
- Important: This print and its subject matter is the property of Equus Compute Solutions ("ECS") and is to be held in strict confidence. It may contain proprietary information, trade secrets, and/or other intellectual property which are owned by ECS. It may only be used for the submitted purpose. This print is not to be forwarded to other parties nor reprinted in any form without ECS's permission.
- Project Name
- Engineer
- Checker
- Date
- Sheet Title
- Doc. No.
- Rev
- File
- Size
- B
- Sheet
- of

### Library data of the parts
C31 = CMP-001-00084-4: Ceramic Capacitor, Multilayer, Ceramic, 10uF, 16V, 10%, X6S, 0805; RoHS Compliant: Yes; Case/Package: 0805; Pins: 2; Min Operating Temperature: -55°C; Voltage Rating: 16V; JLCPN: C162413; Capacitor Type: Ceramic; Tolerance: 10%; Mounting Technology: Surface Mount; Max Operating Temperature: 105°C
C32-C34 = CMP-001-00102-4: as C29 on sheet RP2350; Max Operating Temperature: 125°C; RoHS Compliant: Yes; Case/Package: 0603; Mounting Technology: Surface Mount; Capacitor Type: Ceramic; Pins: 2; Voltage Rating: 100V; Min Operating Temperature: -55°C; JLCPN: C113803
J2 = CMP-002-00236-8: 20V USB C 2.0 16P Female header; JLCPN: C165948
JP1 JP2 = CMP-009-00341-2: 0603 Solder Bridge Jumper Surface Mount; Tolerance: 1%; Voltage Rating: 75V; Value: 0; Pins: 2; Case/Package: 0603; RoHS Compliant: Yes; Max Operating Temperature: 155°C; Min Operating Temperature: -55°C; Mounting Technology: Surface Mount
R22 R23 = CMP-009-00331-3: Fixed Resistor, Metal Glaze/thick Film, 0.1W, 5100ohm, 75V, 1% +/-Tol, 100ppm/Cel, Surface Mount, 0603; Power: 100mW; JLCPN: C23186; Case/Package: 0603; Tolerance: 1%; Voltage Rating: 75V; Pins: 2; RoHS Compliant: Yes; Max Operating Temperature: 155°C; Mounting Technology: Surface Mount; Min Operating Temperature: -55°C
R24 = CMP-009-00343-1: Fixed Resistor, Metal Glaze/thick Film, 0.1W, 4700ohm, 75V, 1% +/-Tol, 100ppm/Cel, Surface Mount, 0603; Power: 100mW; Tolerance: 1%; Case/Package: 0603; Pins: 2; RoHS Compliant: Yes; Mounting Technology: Surface Mount; Voltage Rating: 75V; Max Operating Temperature: 155°C; Min Operating Temperature: -55°C
R25 = CMP-009-00306-2: Fixed Resistor, Metal Glaze/thick Film, 0.1W, 10000ohm, 75V, 1% +/-Tol, 100ppm/Cel, Surface Mount, 0603; Power: 100mW; Voltage Rating: 50V; Max Operating Temperature: 155°C; Min Operating Temperature: -55°C; JLCPN: C98220; Mounting Technology: Surface Mount; Case/Package: 0603; Tolerance: 1%; RoHS Compliant: Yes; Pins: 2
U2 = CMP-015-00034-4: Integrated Circuit Interface USB-UART; RS-232; 12Mbs; 3.3-5.25V; -40+85 deg.C; SMD; SSOP28; Min Supply Voltage: 3.3V; Max Supply Voltage: 5.25V; Min Operating Temperature: -40°C; Pins: 28; Max Operating Temperature: 85°C; Mounting Technology: Surface Mount; Case/Package: SSOP
U5 = CMP-128-000006-4: Very low capacitance ESD protection; Part_Type: IC; Manufacturer: STMICROELECTRONICS; Value: USBLC6-2SC6; Manufacturer_Part_Number: USBLC6-2SC6; JLCPN: C7519

## Sheet Power.SchDoc
size B; SheetNumber: 6; SheetTotal: 7
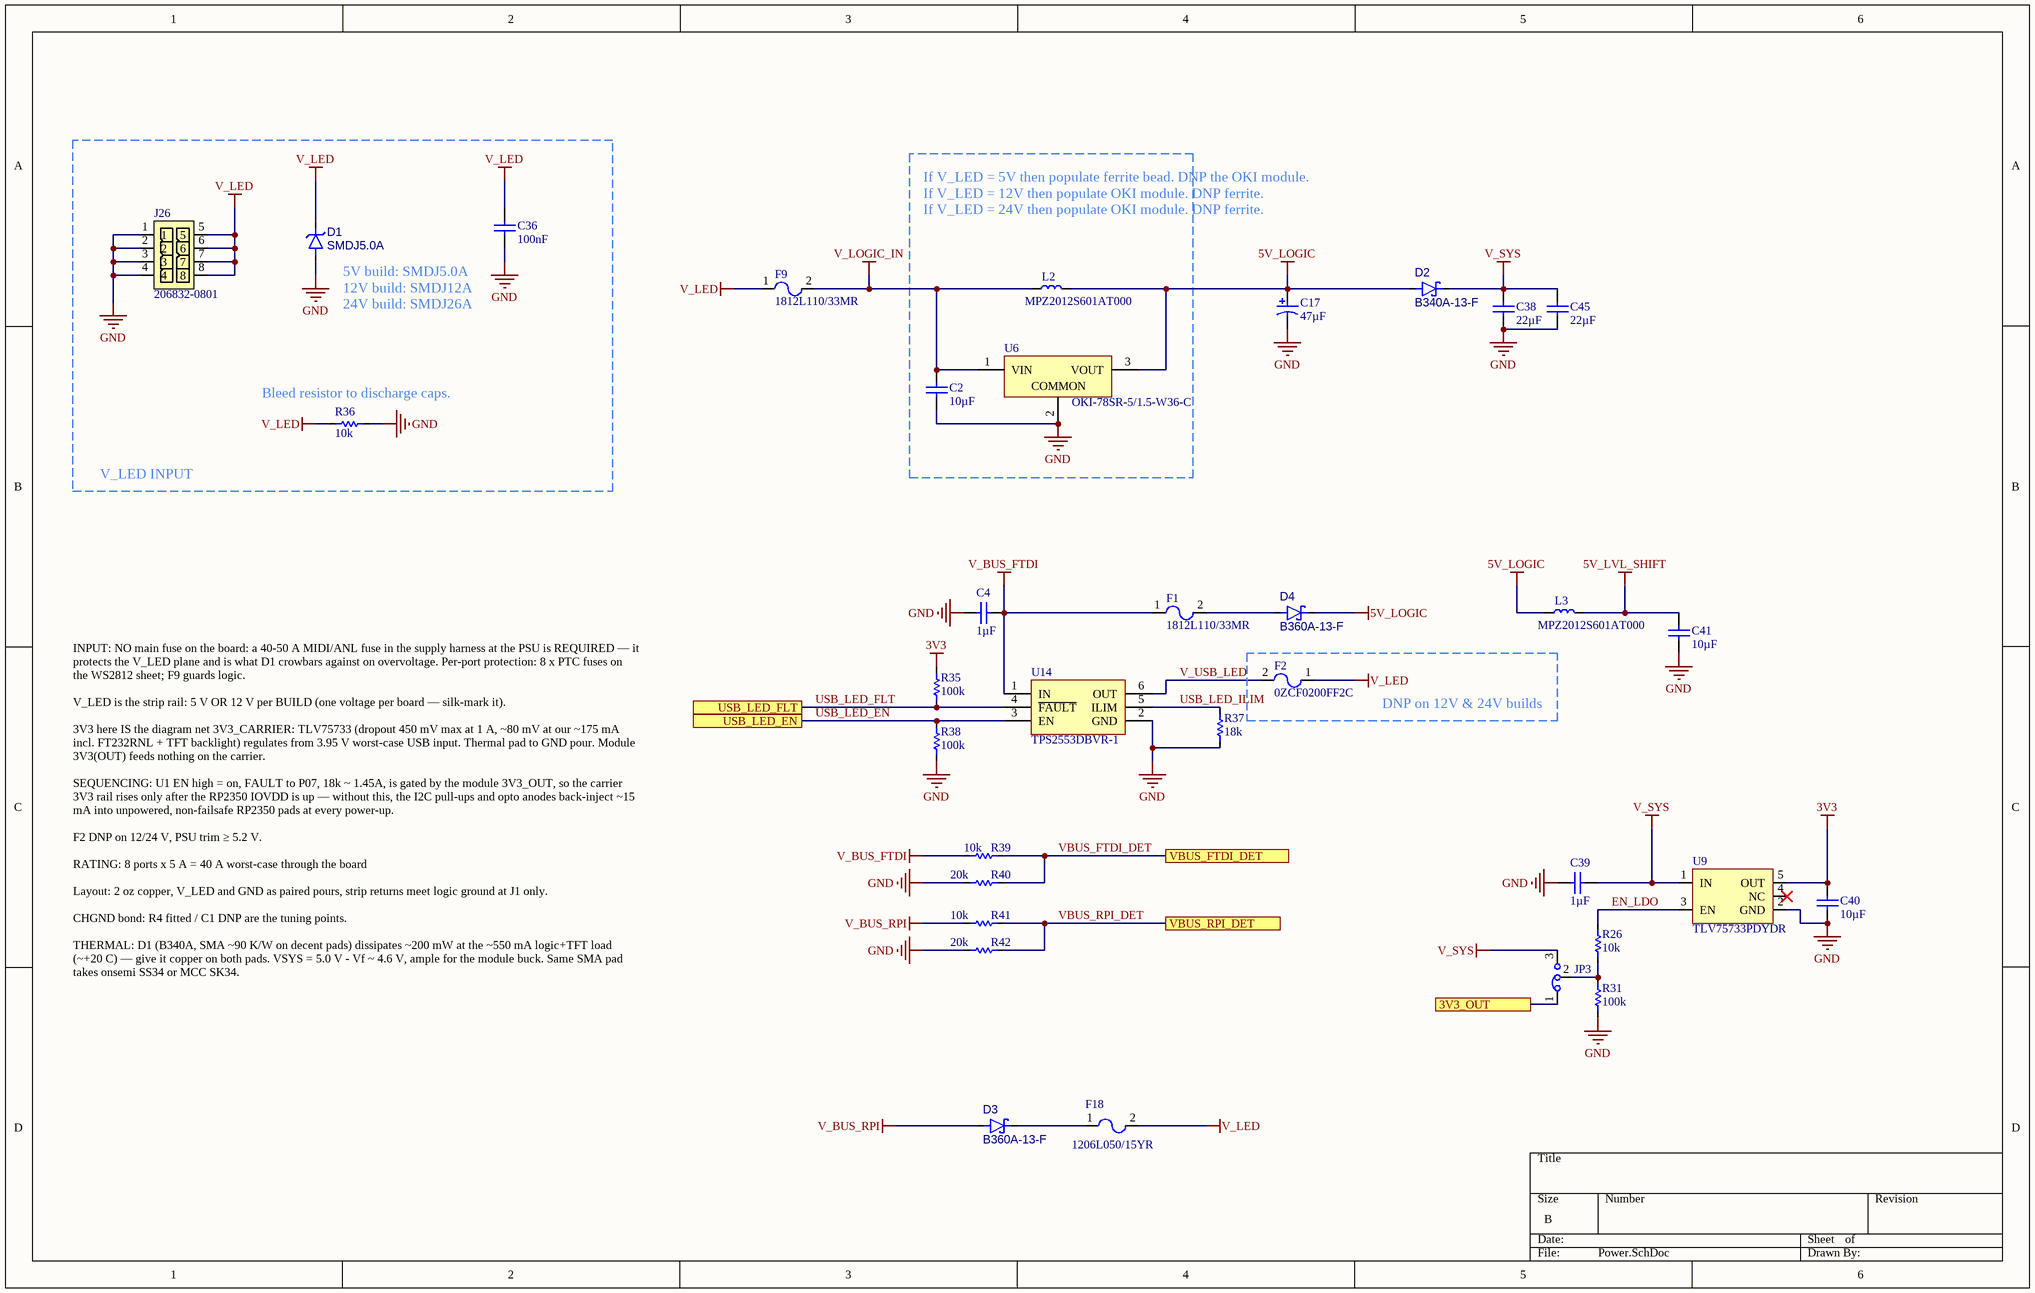
[diagram p5: Power.SchDoc]

### Parts
C2  value 10µF  [CAPC2012X14N_0805_MED]  (hidden comment: GRM21BR61H106KE43L)
C4  value 1µF  [CAPC1608X10N_0603_MED]  (hidden comment: C1608X7R1C105K080AC)
C17  value 47µF  [FP-SP-Cap-X-MFG]  (hidden comment: EEF-CX1C470R)
C36  value 100nF  [CAPC1608X10N_0603_MED]  (hidden comment: CC0603KRX7R0BB104)
C38  value 22µF  [CAPC2012X14N_0805_MED]  (hidden comment: GRM21BC81C226ME44L)
C39  value 1µF  [CAPC1608X10N_0603_MED]  (hidden comment: C1608X7R1C105K080AC)
C40  value 10µF  [CAPC2012X14N_0805_MED]  (hidden comment: GRM21BC81C106KA73L)
C41  value 10µF  [CAPC2012X14N_0805_MED]  (hidden comment: GRM21BC81C106KA73L)
C45  value 22µF  [CAPC2012X14N_0805_MED]  (hidden comment: GRM21BC81C226ME44L)
D1  SMDJ5.0A  [SMDJ_DO-214AB]
D2  B340A-13-F  [DO-214AC_SMA]
D3  B360A-13-F  [FP-SMA-MFG]
D4  B360A-13-F  [FP-SMA-MFG]
F1  1812L110/33MR  [FUSE4532X1.55N_1812MED]
F2  0ZCF0200FF2C  [RESC7451X90M_2920]
F9  1812L110/33MR  [FUSE4532X1.55N_1812MED]
F18  1206L050/15YR  [FP-1206L-MFG]
J26  206832-0801  [206832-0801-Footprint-1]
JP3  Jumper 3 x 1 Bridge 1-2 Solder Bridge  [Jumper 3 Solder Bridge 1-2 0603]  (value not drawn)
L2  MPZ2012S601AT000  [FP-MPZ2012-MFG]
L3  MPZ2012S601AT000  [FP-MPZ2012-MFG]
R26  value 10k  [RESC1608X06N_0603_MED]  (hidden comment: RC0603FR-1010KL)
R31  value 100k  [RESC1608X06N_0603_MED]  (hidden comment: RC0603DR-07100KL)
R35  value 100k  [RESC1608X06N_0603_MED]  (hidden comment: RC0603DR-07100KL)
R36  value 10k  [RESC3116X06N_1206MED]  (hidden comment: RC1206FR-0710KL)
R37  value 18k  [RESC1608X06N_0603_MED]  (hidden comment: RC0603FR-0718KL)
R38  value 100k  [RESC1608X06N_0603_MED]  (hidden comment: RC0603DR-07100KL)
R39  value 10k  [RESC1608X06N_0603_MED]  (hidden comment: RC0603FR-1010KL)
R40  value 20k  [RESC1608X06N_0603_MED]  (hidden comment: RC0603FR-0720KL)
R41  value 10k  [RESC1608X06N_0603_MED]  (hidden comment: RC0603FR-1010KL)
R42  value 20k  [RESC1608X06N_0603_MED]  (hidden comment: RC0603FR-0720KL)
U6  OKI-78SR-5/1.5-W36-C  [MURA-OKI-78SR-3]
U9  TLV75733PDYDR  [SOT95P280X145-5N]
U14  TPS2553DBVR-1  [DBV0006A_N]

### Ports
3V3_OUT, USB_LED_EN, USB_LED_FLT, VBUS_FTDI_DET, VBUS_RPI_DET

### Nets
3V3: C40.2 R35.2 U9.5(OUT)
5V_LOGIC: C17.1 D2.2(A) D4.1(K) L2.2 L3.1 U6.3(VOUT)
5V_LVL_SHIFT: C41.2 L3.2
GND: C2.1 C4.1 C17.2 C36.2 C38.1 C39.1 C40.1 C41.1 C45.1 D1.2(A) J26.1 J26.2 J26.3 J26.4 R31.1 R36.2 R37.1 R38.2 R40.1 R42.1 U6.2(COMMON) U9.2(GND) U14.2(GND)
V_BUS_FTDI: C4.2 F1.1 R39.2 U14.1(IN)
V_BUS_RPI: D3.2(A) R41.2
V_LED: C36.1 D1.1(K) F2.1 F9.1 F18.2 J26.5 J26.6 J26.7 J26.8 R36.1
V_LOGIC_IN: C2.2 F9.2 L2.1 U6.1(VIN)
V_SYS: C38.2 C39.2 C45.2 D2.1(K) JP3.3 U9.1(IN)
EN_LDO: R26.2 U9.3(EN)
USB_LED_EN: R38.1 U14.3(EN) ; port USB_LED_EN
USB_LED_FLT: R35.1 U14.4(~{FAULT}) ; port USB_LED_FLT
USB_LED_ILIM: R37.2 U14.5(ILIM)
V_USB_LED: F2.2 U14.6(OUT)
VBUS_FTDI_DET: R39.1 R40.2 ; port VBUS_FTDI_DET
VBUS_RPI_DET: R41.1 R42.2 ; port VBUS_RPI_DET
NetD3_1: D3.1(K) F18.1
NetD4_2: D4.2(A) F1.2
NetJP3_1: JP3.1 ; port 3V3_OUT
NetJP3_2: JP3.2 R26.1 R31.2

Not connected (* = marked no-connect by the designer): U9 4(NC)*

### Notes on the sheet
- If V_LED = 5V then populate ferrite bead. DNP the OKI module.
  If V_LED = 12V then populate OKI module. DNP ferrite.
  If V_LED = 24V then populate OKI module. DNP ferrite.
- 5V build: SMDJ5.0A
  12V build: SMDJ12A
  24V build: SMDJ26A
- (near R36) Bleed resistor to discharge caps.
- (near R36) V_LED INPUT
- DNP on 12V & 24V builds
- INPUT: NO main fuse on the board: a 40-50 A MIDI/ANL fuse in the supply harness at the PSU is REQUIRED — it protects the V_LED plane and is what D1 crowbars against on overvoltage. Per-port protection: 8 x PTC fuses on the WS2812 sheet; F9 guards logic.
  V_LED is the strip rail: 5 V OR 12 V per BUILD (one voltage per board — silk-mark it).
  3V3 here IS the diagram net 3V3_CARRIER: TLV75733 (dropout 450 mV max at 1 A, ~80 mV at our ~175 mA incl. FT232RNL + TFT backlight) regulates from 3.95 V worst-case USB input. Thermal pad to GND pour. Module 3V3(OUT) feeds nothing on the carrier.
  SEQUENCING: U1 EN high = on, FAULT to P07, 18k ~ 1.45A, is gated by the module 3V3_OUT, so the carrier 3V3 rail rises only after the RP2350 IOVDD is up — without this, the I2C pull-ups and opto anodes back-inject ~15 mA into unpowered, non-failsafe RP2350 pads at every power-up.
  F2 DNP on 12/24 V, PSU trim ≥ 5.2 V.
  RATING: 8 ports x 5 A = 40 A worst-case through the board
  Layout: 2 oz copper, V_LED and GND as paired pours, strip returns meet logic ground at J1 only.
  CHGND bond: R4 fitted / C1 DNP are the tuning points.
  THERMAL: D1 (B340A, SMA ~90 K/W on decent pads) dissipates ~200 mW at the ~550 mA logic+TFT load (~+20 C) — give it copper on both pads. VSYS = 5.0 V - Vf ~ 4.6 V, ample for the module buck. Same SMA pad takes onsemi SS34 or MCC SK34.

### Library data of the parts
C2 = CMP-001-00169-2: Ceramic Capacitor, Multilayer, Ceramic, 10uF, 50V, 10%, X6S, 0805; Case/Package: 0805; Capacitor Type: Ceramic; Mounting Technology: Surface Mount; RoHS Compliant: Yes; Min Operating Temperature: -55°C; Max Operating Temperature: 85°C; Voltage Rating: 50V; Pins: 2; Tolerance: 10%; JLCPN: C440198
C4 C39 = CMP-001-00121-2: Ceramic Capacitor, Multilayer, Ceramic, 16V, 10% +Tol, 10% -Tol, X7R, 15% TC, 1uF, Surface Mount, 0603; Mounting Technology: Surface Mount; Min Operating Temperature: -55°C; Voltage Rating: 16V; Case/Package: 0603; Capacitor Type: Ceramic; JLCPN: C59782; Tolerance: 10%; Pins: 2; RoHS Compliant: Yes; Max Operating Temperature: 125°C
C17 = CMP-001-00179-1: Polymer Aluminum Electrolytic Capacitor, 47 µF, -55 to 105 ¡C; Ripple Current: 1.6A; Tolerance: 20%; Voltage Rating: 16V; Case/Package: 2917; Mounting Technology: Surface Mount; Min Operating Temperature: -55°C; Max Operating Temperature: 105°C
C36 = CMP-001-00102-4: as C29 on sheet RP2350; Max Operating Temperature: 125°C; RoHS Compliant: Yes; Case/Package: 0603; Mounting Technology: Surface Mount; Capacitor Type: Ceramic; Pins: 2; Voltage Rating: 100V; Min Operating Temperature: -55°C; JLCPN: C113803
C38 C45 = CMP-001-00095-1: Ceramic Capacitor, Multilayer, Ceramic, 22uF, 16V, 20%, X6S, 0805; Case/Package: 0805; Capacitor Type: Ceramic; Mounting Technology: Surface Mount; RoHS Compliant: Yes; Min Operating Temperature: -55°C; Max Operating Temperature: 105°C; Voltage Rating: 16V; Pins: 2; Tolerance: 20%
C40 C41 = CMP-001-00084-4: as C31 on sheet FTDI; RoHS Compliant: Yes; Case/Package: 0805; Pins: 2; Min Operating Temperature: -55°C; Voltage Rating: 16V; JLCPN: C162413; Capacitor Type: Ceramic; Tolerance: 10%; Mounting Technology: Surface Mount; Max Operating Temperature: 105°C
D1 = CMP-004-00055-2: SMDJ Series 6.5 W 7 V Uni-Directional Surface Mount TVS Diode - SMC; Max Surge Current: 326.1A; Min Operating Temperature: -65°C; Max Operating Temperature: 150°C; Mounting Technology: Surface Mount; Pins: 2
D2 = CMP-004-00034-2: Rectifier Diode, Schottky, 1 Phase, 1 Element, 3A, 40V V(RRM), Silicon; Forward Voltage: 500mV; Pins: 2; Max Operating Temperature: 125°C; RoHS Compliant: Yes; Min Operating Temperature: -55°C
D3 D4 = CMP-004-00054-1: Rectifier Diode, Schottky, 1 Phase, 1 Element, 3A, 60V V(RRM), Silicon, DO-214AC; Forward Voltage: 700mV; Forward Current: 3A; Pins: 2; Max Operating Temperature: 150°C; Case/Package: SMA; Min Operating Temperature: -55°C; Mounting Technology: Surface Mount
F1 F9 = CMP-005-00022-1: PTC Resettable Fuse 1.1A(hold) 1.95A(trip) 33VDC 20A 0.8W 0.5s 0.06Ohm SMD Solder Pad 1812 T/R; Trip Current Rating: 1.9A; Hold Current Rating: 1.1A; Mounting Technology: Surface Mount; Case/Package: 1812; Min Operating Temperature: -40°C; Max Operating Temperature: 85°C
F2 = CMP-005-00026-1: SMD Resettable Fuse, PPTC, 2920 [7351 Metric], 0ZCF, 16 VDC, 2 A, 4 A, 4.5 s; Mounting Technology: Surface Mount; Min Operating Temperature: -40°C; Max Operating Temperature: 85°C
F18 = CMP-005-00020-2: PTC Resettable Fuse 0.5A(hold) 1A(trip) 15VDC 100A 0.6W 0.1s 0.15Ohm SMD Solder Pad 1206 T/R; Case/Package: 1206; Min Operating Temperature: -40°C; Current Rating: 100A; Max Operating Temperature: 85°C; JLCPN: C151162; Mounting Technology: Surface Mount
J26 = CMP-002-00208-6: Micro-Fit+, Vertical Header, 8 pin; Max Current Rating: 12.5A; Connector Type: Micro-Fit+; Mounting Technology: Through Hole; Pins: 8
JP3 = CMP-009-00341-2: as JP1 on sheet FTDI; Pins: 2; Case/Package: 0603; RoHS Compliant: Yes; Max Operating Temperature: 155°C; Min Operating Temperature: -55°C; Mounting Technology: Surface Mount
L2 L3 = CMP-006-00035-1: Ferrite Beads Multi-Layer Power 600Ohm 25% 100MHz 2A 0.1Ohm DCR 0805 T/R; Tolerance: 25%; Case/Package: 0805; Mounting Technology: Surface Mount; Current Rating: 2A; Max Operating Temperature: 125°C; Min Operating Temperature: -55°C
R26 R39 R41 = CMP-009-00306-2: as R25 on sheet FTDI; Max Operating Temperature: 155°C; Min Operating Temperature: -55°C; JLCPN: C98220; Mounting Technology: Surface Mount; Case/Package: 0603; Tolerance: 1%; RoHS Compliant: Yes; Pins: 2
R31 R35 R38 = CMP-009-00328-3: as R2 on sheet DMX; Min Operating Temperature: -55°C; Mounting Technology: Surface Mount; RoHS Compliant: Yes; Pins: 2; JLCPN: C25803; Max Operating Temperature: 155°C; Case/Package: 0603; Tolerance: 0.5%
R36 = CMP-009-00344-1: Fixed Resistor, Metal Glaze/thick Film, 0.25W, 20000ohm, 200V, 1% +/-Tol, 100ppm/Cel, Surface Mount, 1206; Power: 250mW; RoHS Compliant: Yes; Voltage Rating: 200V; Pins: 2; Max Operating Temperature: 155°C; Case/Package: 1206; Mounting Technology: Surface Mount; Tolerance: 1%; Min Operating Temperature: -55°C
R37 = CMP-009-00346-2: 100mW Thick Film Resistors 75V ±100ppm/℃ ±1% 18kΩ 0603 Chip Resistor - Surface Mount ROHS; Tolerance: 1%; Power: 100mW; Case/Package: 0603; Mounting Technology: Surface Mount; RoHS Compliant: Yes; Min Operating Temperature: -55°C; Pins: 2; Max Operating Temperature: 155°C; Voltage Rating: 75V
R40 R42 = CMP-009-00345-1: 100mW Thick Film Resistors 75V ±100ppm/℃ ±1% 20kΩ 0603 Chip Resistor - Surface Mount ROHS; JLCPN: C123417; Tolerance: 1%; Min Operating Temperature: -55°C; Pins: 2; Mounting Technology: Surface Mount; Case/Package: 0603; RoHS Compliant: Yes; Max Operating Temperature: 155°C; Power: 100mW; Voltage Rating: 75V
U6 = CMP-019-00084-3: 8 W Single Output 5 V Non Isolated Through Hole DC/DC Converter; Max Power Dissipation: 7.8W; Min Supply Voltage: 7V; Output Voltage: 5V; Output Current: 1.5A; Max Supply Voltage: 36V; Case/Package: SMA; Pins: 3; Max Operating Temperature: 85°C; Mounting Technology: Through Hole; Min Operating Temperature: -40°C
U9 = CMP-019-00080-1: 1-A, low-IQ high-accuracy low-dropout (LDO) voltage regulator with enable 5-SOT-23 -40 to 125; Max Supply Voltage: 5.5V; Dropout Voltage: 425mV; Output Voltage: 3.3V; Case/Package: SOT-23; Pins: 5
U14 = CMP-019-00083-1: IC PWR SWITCH N-CHAN 1: 1 SOT23-6 Power Switch/Driver 1: 1 N-Channel 1.5A SOT-23-6; Max Supply Voltage: 6.5V; Min Supply Voltage: 2.5V; Min Operating Temperature: -40°C; Pins: 6; Max Operating Temperature: 85°C; Case/Package: SOT-23

## Sheet UI.SchDoc
size B; SheetNumber: 7; SheetTotal: 7
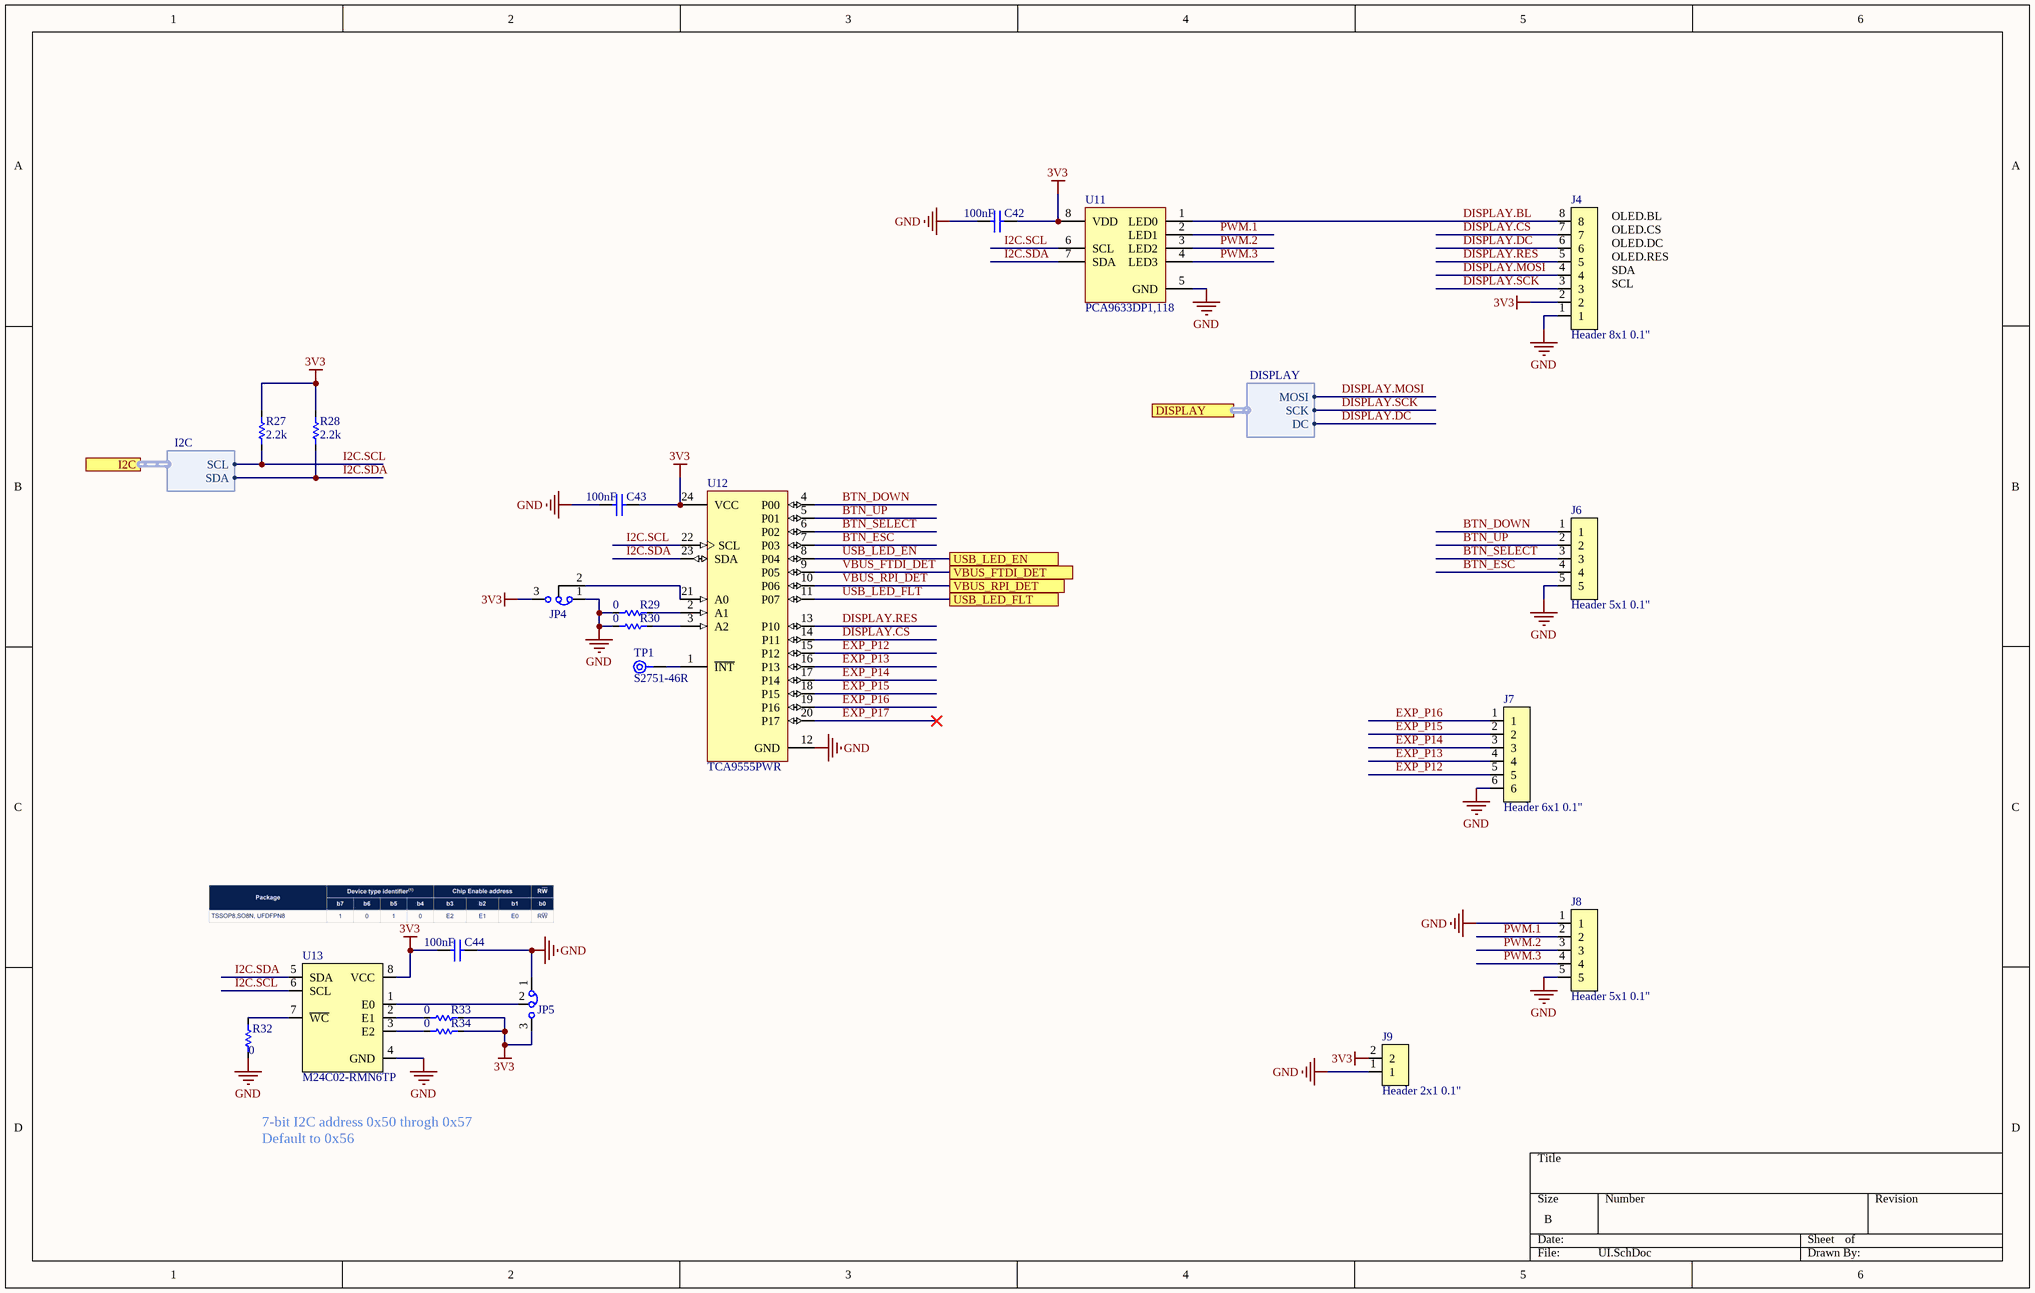
[diagram p6: UI.SchDoc]

### Parts
C42  value 100nF  [CAPC1608X10N_0603_MED]  (hidden comment: CC0603KRX7R0BB104)
C43  value 100nF  [CAPC1608X10N_0603_MED]  (hidden comment: CC0603KRX7R0BB104)
C44  value 100nF  [CAPC1608X10N_0603_MED]  (hidden comment: CC0603KRX7R0BB104)
J4  Header 8x1 0.1"  [HEADER 8x1 0.1"]
J6  Header 5x1 0.1"  [HEADER 5x1 0.1"]
J7  Header 6x1 0.1"  [Copy of HEADER 7x1 0.1"]
J8  Header 5x1 0.1"  [HEADER 5x1 0.1"]
J9  Header 2x1 0.1"  [FP-M20-9990245-MFG]
JP4  Jumper 3 x 1 Bridge 1-2 Solder Bridge  [Jumper 3 Solder Bridge 1-2 0603]  (value not drawn)
JP5  Jumper 3 x 1 Bridge 1-2 Solder Bridge  [Jumper 3 Solder Bridge 1-2 0603]  (value not drawn)
R27  value 2.2k  [RESC1608X06N_0603_MED]  (hidden comment: RC0603FR-072K2L)
R28  value 2.2k  [RESC1608X06N_0603_MED]  (hidden comment: RC0603FR-072K2L)
R29  value 0  [RESC1608X06N_0603_MED]  (hidden comment: RC0603FR-070RL)
R30  value 0  [RESC1608X06N_0603_MED]  (hidden comment: RC0603FR-070RL)
R32  value 0  [RESC1608X06N_0603_MED]  (hidden comment: RC0603FR-070RL)
R33  value 0  [RESC1608X06N_0603_MED]  (hidden comment: RC0603FR-070RL)
R34  value 0  [RESC1608X06N_0603_MED]  (hidden comment: RC0603FR-070RL)
TP1  S2751-46R  [S2751-46R]
U11  PCA9633DP1,118  [NXP-TSSOP-8_M]
U12  TCA9555PWR  [PW0024A_M]
U13  M24C02-RMN6TP  [M24C02-RMN6TP-SO8N-IPC_B]

### Ports
DISPLAY (harness DISPLAY), I2C (harness I2C), USB_LED_EN, USB_LED_FLT, VBUS_FTDI_DET, VBUS_RPI_DET

### Harnesses
DISPLAY: MOSI, DC, SCK
I2C: SCL, SDA

### Nets
3V3: C42.2 C43.2 C44.1 J4.2 J9.2 JP4.3 JP5.3 R27.2 R28.2 R33.1 R34.1 U11.8(VDD) U12.24(VCC) U13.8(VCC)
GND: C42.1 C43.1 C44.2 J4.1 J6.5 J7.6 J8.1 J8.5 J9.1 JP4.1 JP5.1 R29.2 R30.2 R32.2 U11.5(GND) U12.12(GND) U13.4(GND)
BTN_DOWN: J6.1 U12.4(P00)
BTN_ESC: J6.4 U12.7(P03)
BTN_SELECT: J6.3 U12.6(P02)
BTN_UP: J6.2 U12.5(P01)
DISPLAY.BL: J4.8 U11.1(LED0)
DISPLAY.CS: J4.7 U12.14(P11)
DISPLAY.DC: J4.6 ; port DISPLAY.DC
DISPLAY.MOSI: J4.4 ; port DISPLAY.MOSI
DISPLAY.RES: J4.5 U12.13(P10)
DISPLAY.SCK: J4.3 ; port DISPLAY.SCK
EXP_P12: J7.5 U12.15(P12)
EXP_P13: J7.4 U12.16(P13)
EXP_P14: J7.3 U12.17(P14)
EXP_P15: J7.2 U12.18(P15)
EXP_P16: J7.1 U12.19(P16)
EXP_P17: U12.20(P17)
I2C.SCL: R27.1 U11.6(SCL) U12.22(SCL) U13.6(SCL) ; port I2C.SCL
I2C.SDA: R28.1 U11.7(SDA) U12.23(SDA) U13.5(SDA) ; port I2C.SDA
PWM.1: J8.2 U11.2(LED1)
PWM.2: J8.3 U11.3(LED2)
PWM.3: J8.4 U11.4(LED3)
USB_LED_EN: U12.8(P04) ; port USB_LED_EN
USB_LED_FLT: U12.11(P07) ; port USB_LED_FLT
VBUS_FTDI_DET: U12.9(P05) ; port VBUS_FTDI_DET
VBUS_RPI_DET: U12.10(P06) ; port VBUS_RPI_DET
NetJP4_2: JP4.2 U12.21(A0)
NetJP5_2: JP5.2 U13.1(E0)
NetR29_1: R29.1 U12.2(A1)
NetR30_1: R30.1 U12.3(A2)
NetR32_1: R32.1 U13.7(~{WC})
NetR33_2: R33.2 U13.2(E1)
NetR34_2: R34.2 U13.3(E2)
NetTP1_1: TP1.1 U12.1(~{INT})

### Notes on the sheet
- (near J4) OLED.BL
  OLED.CS
  OLED.DC
  OLED.RES
  SDA
  SCL
- 7-bit I2C address 0x50 throgh 0x57
  Default to 0x56

### Library data of the parts
C42-C44 = CMP-001-00102-4: as C29 on sheet RP2350; Max Operating Temperature: 125°C; RoHS Compliant: Yes; Case/Package: 0603; Mounting Technology: Surface Mount; Capacitor Type: Ceramic; Pins: 2; Voltage Rating: 100V; Min Operating Temperature: -55°C; JLCPN: C113803
J4 = CMP-002-00240-1: Conn Header Vert 8POS 2.54MM; Gender: Male; Mounting Technology: THROUGH HOLE; Pins: 8; Connector Type: Header
J6 J8 = CMP-002-00239-1: Conn Header Vert 5POS 2.54MM; Gender: Male; Mounting Technology: Through Hole; Pins: 5; Connector Type: Header
J7 = CMP-002-00250-1: Conn Header Vert 6POS 2.54MM; Gender: Male; Pins: 6; Mounting Technology: Through Hole; Connector Type: Header
J9 = CMP-002-00082-2: as J14 on sheet RP2350; Min Operating Temperature: -40°C; Mounting Technology: Through Hole; Pins: 2; Max Operating Temperature: 105°C; RoHS Compliant: Yes
JP4 JP5 = CMP-009-00341-2: as JP1 on sheet FTDI; Pins: 2; Case/Package: 0603; RoHS Compliant: Yes; Max Operating Temperature: 155°C; Min Operating Temperature: -55°C; Mounting Technology: Surface Mount
R27 R28 = CMP-009-00304-2: as R14 on sheet DMX; Min Operating Temperature: -55°C; Max Operating Temperature: 155°C; Tolerance: 1%; Case/Package: 0603; Pins: 2; Mounting Technology: Surface Mount; RoHS Compliant: Yes; JLCPN: C114662
R29 R30 R32-R34 = CMP-009-00204-6: as R4 on sheet DMX; Mounting Technology: Surface Mount; Pins: 2; Case/Package: 0603; Max Operating Temperature: 155°C; Min Operating Temperature: -55°C; RoHS Compliant: Yes; JLCPN: C21189
TP1 = CMP-00028-00009-4: Test Point; Pins: 1
U11 = CMP-015-00036-1: PCA9633 Series 25 mA 5.5 V 1 MHz SMT 8-bit I2C-Bus LED Driver - TSSOP-8; Max Supply Voltage: 5.5V; Min Supply Voltage: 2.3V; Case/Package: TSSOP; Min Operating Temperature: -40°C; Max Operating Temperature: 85°C; Pins: 8
U12 = CMP-015-00012-2: 16-bit 1.65- to 5.5-V I2C/SMBus I/O expander with interrupt, weak pull-up & config registers; Nominal Supply Voltage: 1.8V; Min Supply Voltage: 1.65V; Max Supply Voltage: 5.5V; Min Operating Temperature: -40°C; RoHS Compliant: Yes; Case/Package: TSSOP; Pins: 24; Max Operating Temperature: 85°C
U13 = CMP-019-00078-2: M24C02 Series 2 Kb (256 x 8) 1.8 V SMT Serial I²C Bus EEPROM - SOIC-8; Max Supply Voltage: 5.5V; Min Supply Voltage: 1.8V; Frequency: 400kHz; Memory Size: 256B; Case/Package: SOIC; Pins: 8; Clock Frequency: 400kHz; Min Operating Temperature: -40°C; Memory Format: EEPROM; Max Operating Temperature: 85°C; Mounting Technology: Surface Mount; JLCPN: C83836

## Nets that join several sheets
3V3: DMX (7 pins), FTDI (5 pins), Power (C40.2 R35.2 U9.5), UI (14 pins)
5V_LVL_SHIFT: WS2812 (C23.2 R5.2 U10.20), Power (C41.2 L3.2)
CHGND: Block Diagram (PTH3.1), DMX (5 pins)
GND: RP2350 (11 pins), WS2812 (19 pins), DMX (10 pins), FTDI (19 pins), Power (23 pins), UI (17 pins)
V_BUS_FTDI: FTDI (J2.A4B9 J2.B4A9 R24.2 U5.5), Power (C4.2 F1.1 R39.2 U14.1)
V_BUS_RPI: RP2350 (U1.40), Power (D3.2 R41.2)
V_LED: WS2812 (8 pins), Power (10 pins)
V_SYS: RP2350 (C29.1 U1.39), Power (6 pins)
DISPLAY.DC: RP2350 (U1.16), UI (J4.6)
DISPLAY.MOSI: RP2350 (U1.15), UI (J4.4)
DISPLAY.SCK: RP2350 (U1.19), UI (J4.3)
DMX.EN: RP2350 (U1.14), DMX (R12.1)
DMX.RX: RP2350 (U1.11), DMX (R14.1 U8.5)
DMX.TX: RP2350 (U1.12), DMX (R9.1)
FTDI.RX: RP2350 (U1.34), FTDI (JP1.3 JP2.1)
FTDI.TX: RP2350 (U1.17), FTDI (JP1.1 JP2.3)
I2C.SCL: RP2350 (U1.32), UI (R27.1 U11.6 U12.22 U13.6)
I2C.SDA: RP2350 (U1.31), UI (R28.1 U11.7 U12.23 U13.5)
LED.1: RP2350 (U1.1), WS2812 (U10.9)
LED.2: RP2350 (U1.2), WS2812 (U10.8)
LED.3: RP2350 (U1.4), WS2812 (U10.7)
LED.4: RP2350 (U1.5), WS2812 (U10.6)
LED.5: RP2350 (U1.6), WS2812 (U10.5)
LED.6: RP2350 (U1.7), WS2812 (U10.4)
LED.7: RP2350 (U1.9), WS2812 (U10.3)
LED.8: RP2350 (U1.10), WS2812 (U10.2)
NetJP3_1: RP2350 (U1.36), Power (JP3.1)
USB_LED_EN: Power (R38.1 U14.3), UI (U12.8)
USB_LED_FLT: Power (R35.1 U14.4), UI (U12.11)
VBUS_FTDI_DET: Power (R39.1 R40.2), UI (U12.9)
VBUS_RPI_DET: Power (R41.1 R42.2), UI (U12.10)

## Assembly variants
Production: not fitted C? TP? U?